# EAGLE design 2024-03-01_Twin_Io_Schematic (EAGLE 9.6.0)
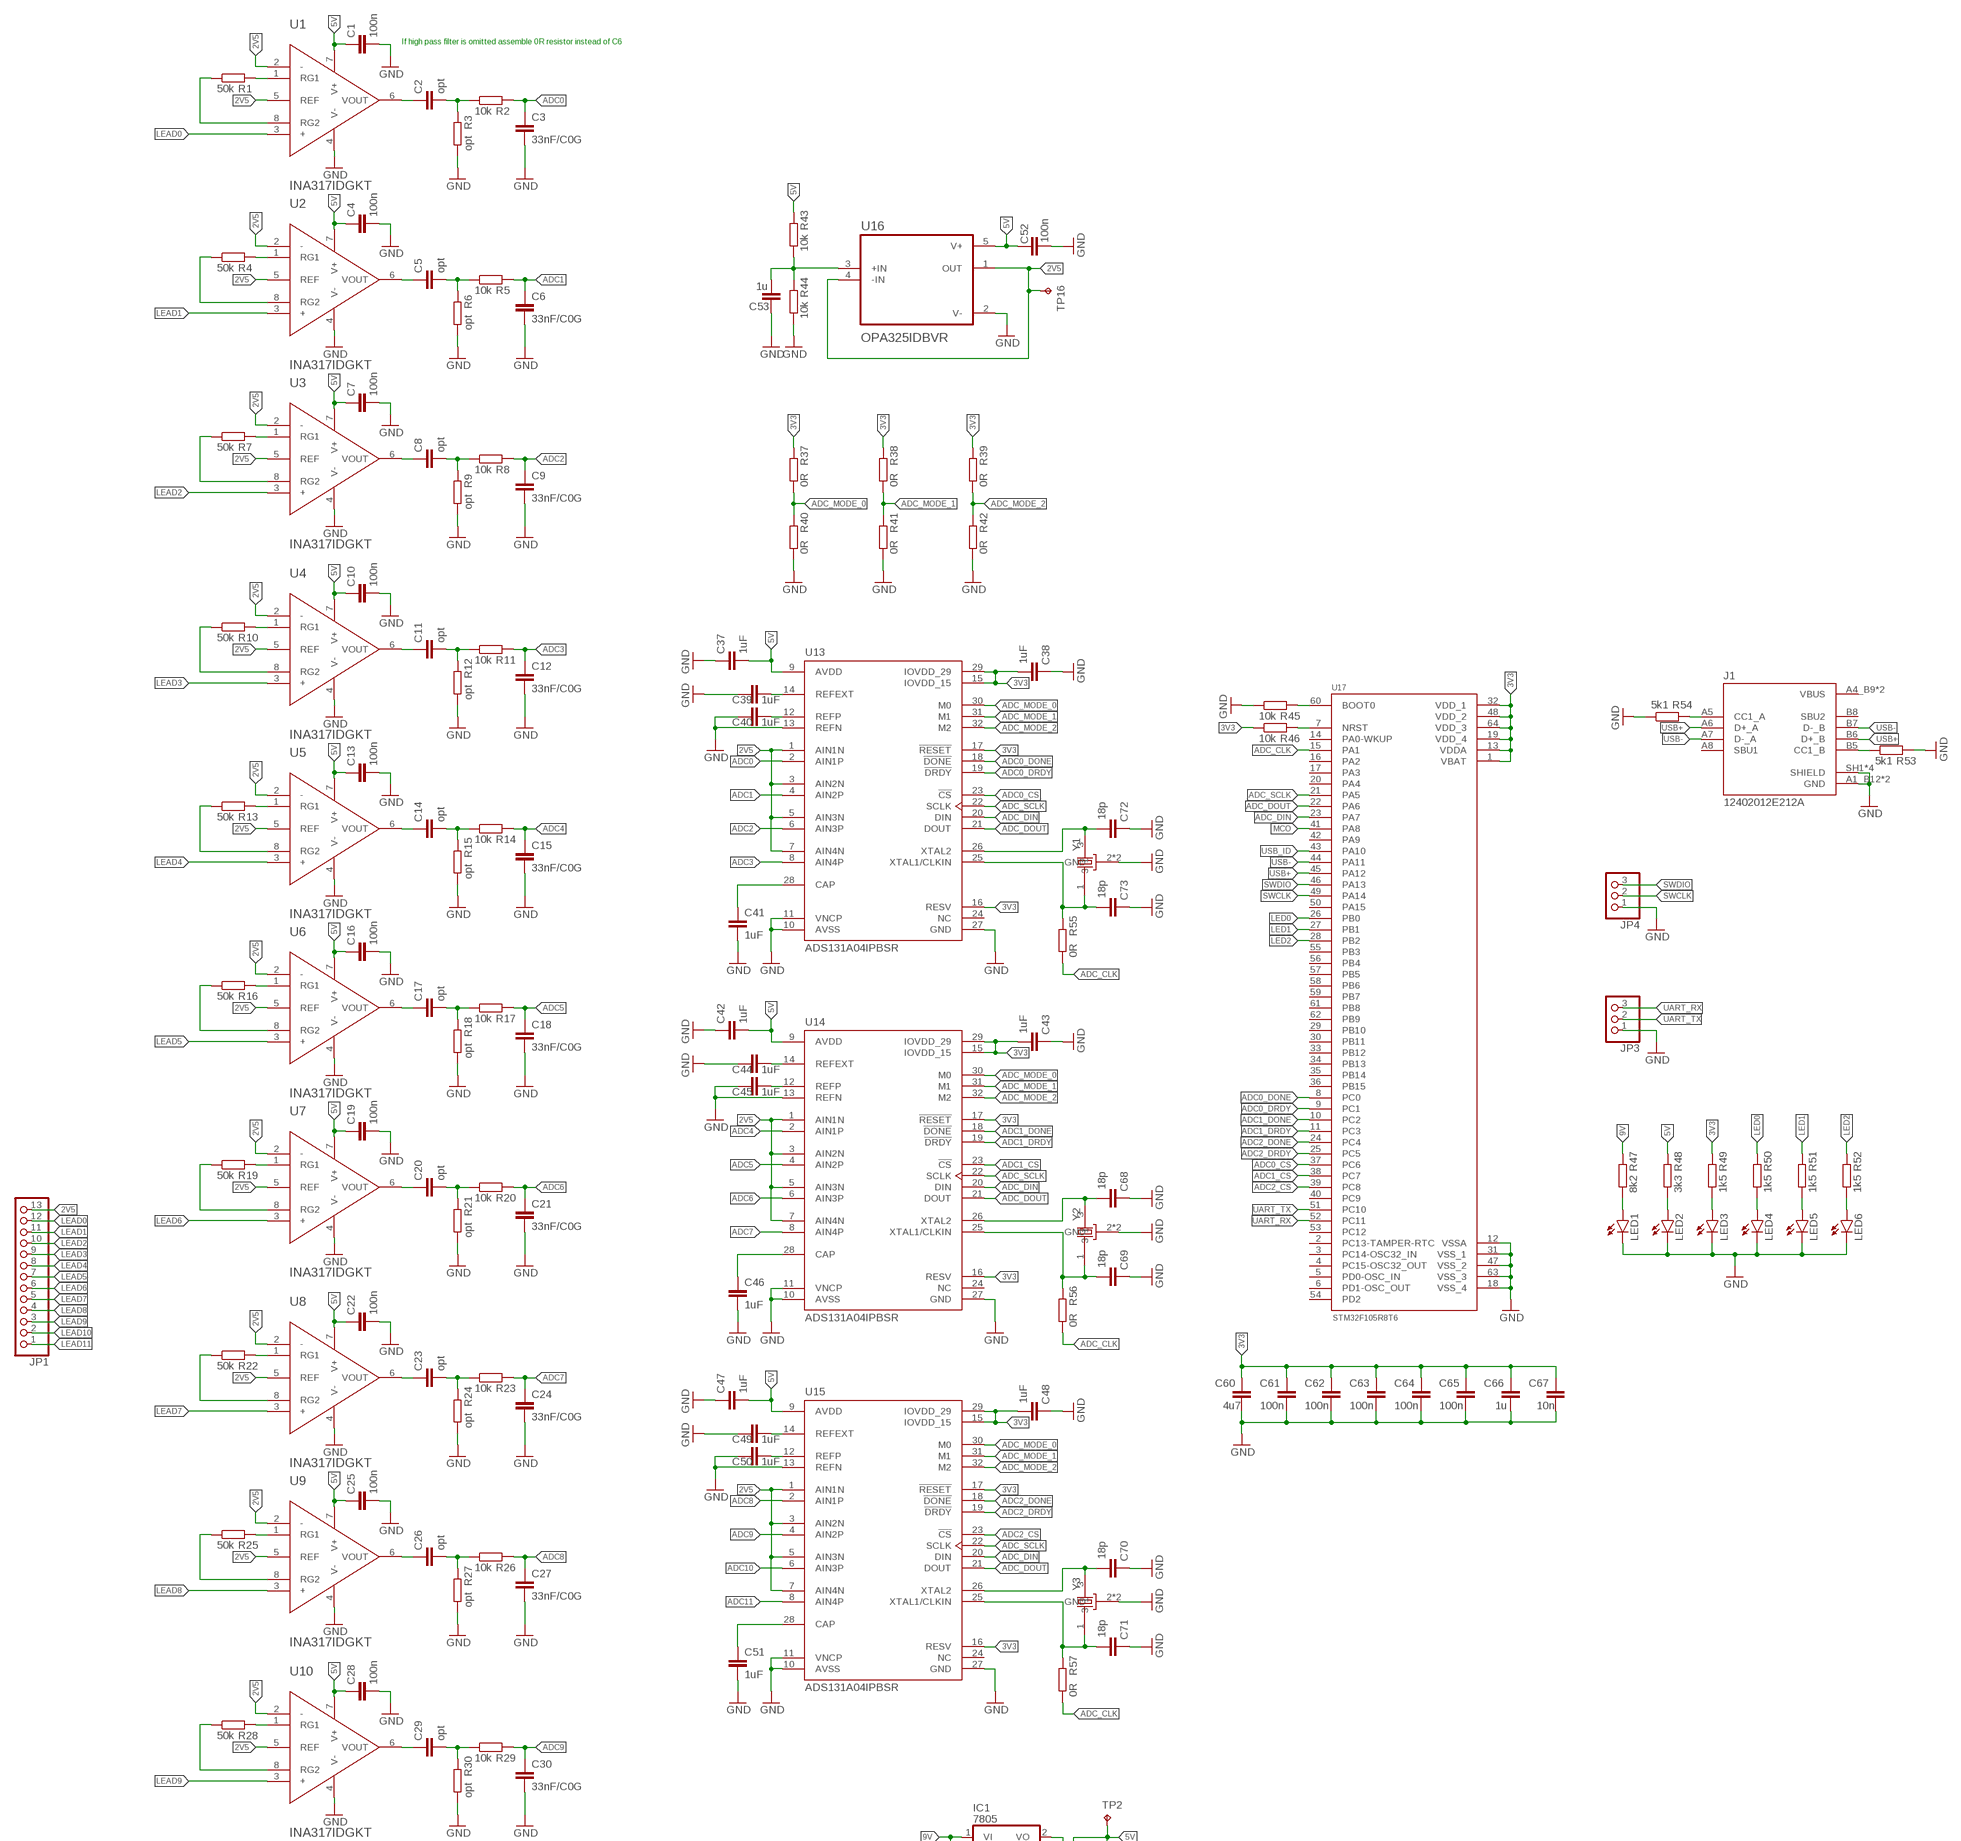
[diagram p0: schematic, sheet 1, part 1 of 2]
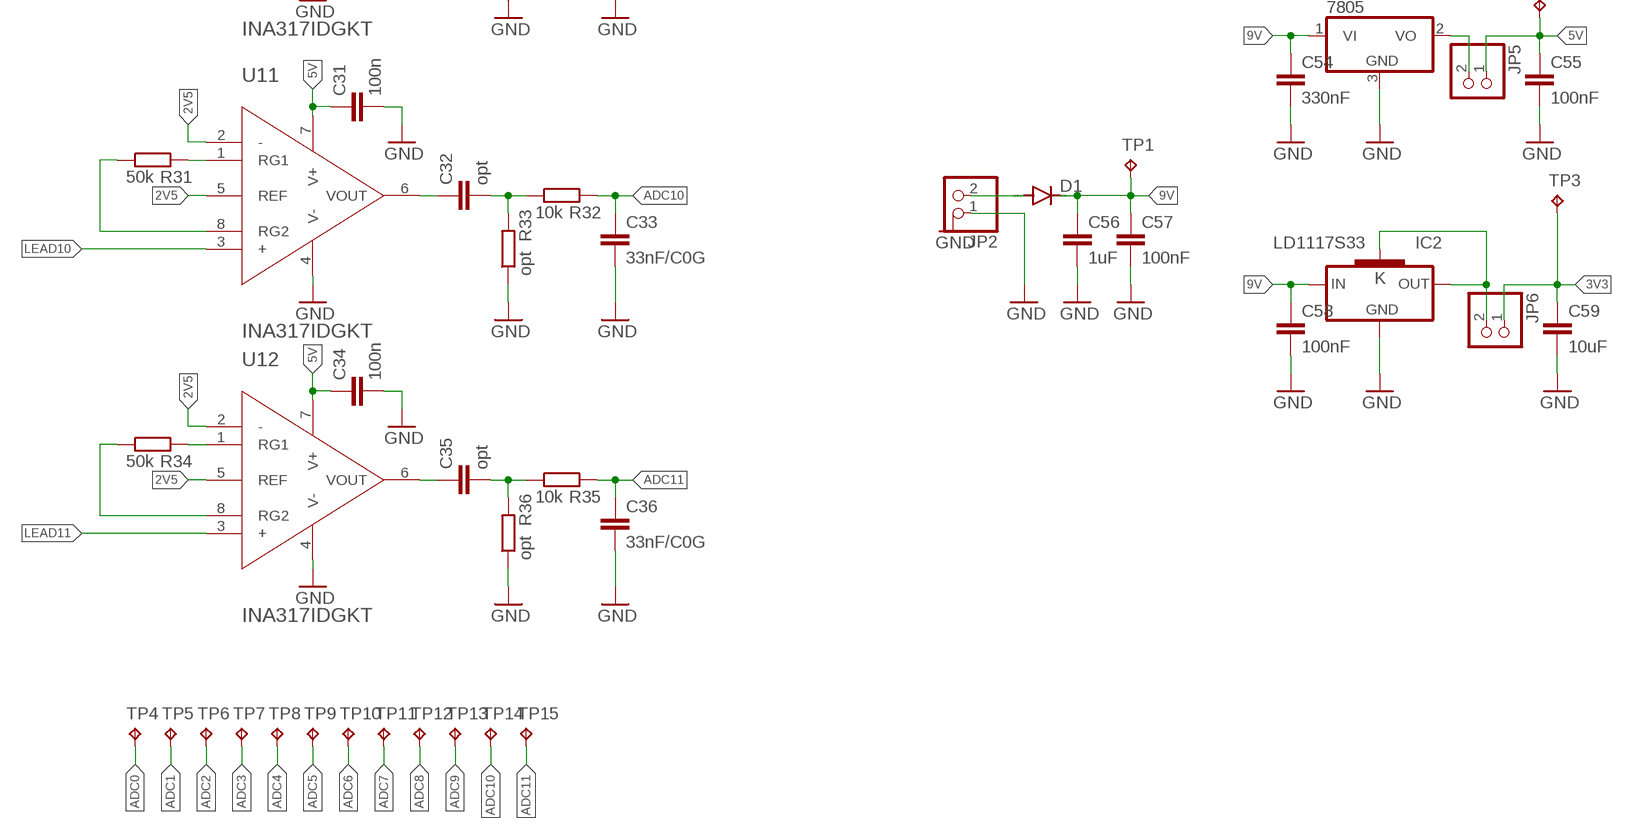
[diagram p1: schematic, sheet 1, part 2 of 2]

## Parts
C1  100n  C-EUC0603  [C0603]
C2  opt  C-EUC0603  [C0603]
C3  33nF/C0G  C-EUC0603  [C0603]
C4  100n  C-EUC0603  [C0603]
C5  opt  C-EUC0603  [C0603]
C6  33nF/C0G  C-EUC0603  [C0603]
C7  100n  C-EUC0603  [C0603]
C8  opt  C-EUC0603  [C0603]
C9  33nF/C0G  C-EUC0603  [C0603]
C10  100n  C-EUC0603  [C0603]
C11  opt  C-EUC0603  [C0603]
C12  33nF/C0G  C-EUC0603  [C0603]
C13  100n  C-EUC0603  [C0603]
C14  opt  C-EUC0603  [C0603]
C15  33nF/C0G  C-EUC0603  [C0603]
C16  100n  C-EUC0603  [C0603]
C17  opt  C-EUC0603  [C0603]
C18  33nF/C0G  C-EUC0603  [C0603]
C19  100n  C-EUC0603  [C0603]
C20  opt  C-EUC0603  [C0603]
C21  33nF/C0G  C-EUC0603  [C0603]
C22  100n  C-EUC0603  [C0603]
C23  opt  C-EUC0603  [C0603]
C24  33nF/C0G  C-EUC0603  [C0603]
C25  100n  C-EUC0603  [C0603]
C26  opt  C-EUC0603  [C0603]
C27  33nF/C0G  C-EUC0603  [C0603]
C28  100n  C-EUC0603  [C0603]
C29  opt  C-EUC0603  [C0603]
C30  33nF/C0G  C-EUC0603  [C0603]
C31  100n  C-EUC0603  [C0603]
C32  opt  C-EUC0603  [C0603]
C33  33nF/C0G  C-EUC0603  [C0603]
C34  100n  C-EUC0603  [C0603]
C35  opt  C-EUC0603  [C0603]
C36  33nF/C0G  C-EUC0603  [C0603]
C37  1uF  C-EUC0603  [C0603]
C38  1uF  C-EUC0603  [C0603]
C39  1uF  C-EUC0603  [C0603]
C40  1uF  C-EUC0603  [C0603]
C41  1uF  C-EUC0603  [C0603]
C42  1uF  C-EUC0603  [C0603]
C43  1uF  C-EUC0603  [C0603]
C44  1uF  C-EUC0603  [C0603]
C45  1uF  C-EUC0603  [C0603]
C46  1uF  C-EUC0603  [C0603]
C47  1uF  C-EUC0603  [C0603]
C48  1uF  C-EUC0603  [C0603]
C49  1uF  C-EUC0603  [C0603]
C50  1uF  C-EUC0603  [C0603]
C51  1uF  C-EUC0603  [C0603]
C52  100n  C-EUC0603  [C0603]
C53  1u  C-EUC0603  [C0603]
C54  330nF  C-EUC0603  [C0603]
C55  100nF  C-EUC0603  [C0603]
C56  1uF  C-EUC0603  [C0603]
C57  100nF  C-EUC0603  [C0603]
C58  100nF  C-EUC0603  [C0603]
C59  10uF  C-EUC0603  [C0603]
C60  4u7  C-EUC0603  [C0603]
C61  100n  C-EUC0603  [C0603]
C62  100n  C-EUC0603  [C0603]
C63  100n  C-EUC0603  [C0603]
C64  100n  C-EUC0603  [C0603]
C65  100n  C-EUC0603  [C0603]
C66  1u  C-EUC0603  [C0603]
C67  10n  C-EUC0603  [C0603]
C68  18p  C-EUC0603  [C0603]
C69  18p  C-EUC0603  [C0603]
C70  18p  C-EUC0603  [C0603]
C71  18p  C-EUC0603  [C0603]
C72  18p  C-EUC0603  [C0603]
C73  18p  C-EUC0603  [C0603]
D1  DIODE-DO214AA  [DO214AA]
IC1  7805  7806DT  [TO252]
IC2  LD1117S33  [SOT223]
J1  12402012E212A  [AMPHENOL_12402012E212A]
JP1  PINHD-1X13  [1X13]
JP2  PINHD-1X2  [1X02]
JP3  PINHD-1X3  [1X03]
JP4  PINHD-1X3  [1X03]
JP5  PINHD-1X2  [1X02]
JP6  PINHD-1X2  [1X02]
LED1  LEDSML1206  [SML1206]
LED2  LEDSML1206  [SML1206]
LED3  LEDSML1206  [SML1206]
LED4  LEDSML1206  [SML1206]
LED5  LEDSML1206  [SML1206]
LED6  LEDSML1206  [SML1206]
R1  50k  R-EU_R0603  [R0603]
R2  10k  R-EU_R0603  [R0603]
R3  opt  R-EU_R0603  [R0603]
R4  50k  R-EU_R0603  [R0603]
R5  10k  R-EU_R0603  [R0603]
R6  opt  R-EU_R0603  [R0603]
R7  50k  R-EU_R0603  [R0603]
R8  10k  R-EU_R0603  [R0603]
R9  opt  R-EU_R0603  [R0603]
R10  50k  R-EU_R0603  [R0603]
R11  10k  R-EU_R0603  [R0603]
R12  opt  R-EU_R0603  [R0603]
R13  50k  R-EU_R0603  [R0603]
R14  10k  R-EU_R0603  [R0603]
R15  opt  R-EU_R0603  [R0603]
R16  50k  R-EU_R0603  [R0603]
R17  10k  R-EU_R0603  [R0603]
R18  opt  R-EU_R0603  [R0603]
R19  50k  R-EU_R0603  [R0603]
R20  10k  R-EU_R0603  [R0603]
R21  opt  R-EU_R0603  [R0603]
R22  50k  R-EU_R0603  [R0603]
R23  10k  R-EU_R0603  [R0603]
R24  opt  R-EU_R0603  [R0603]
R25  50k  R-EU_R0603  [R0603]
R26  10k  R-EU_R0603  [R0603]
R27  opt  R-EU_R0603  [R0603]
R28  50k  R-EU_R0603  [R0603]
R29  10k  R-EU_R0603  [R0603]
R30  opt  R-EU_R0603  [R0603]
R31  50k  R-EU_R0603  [R0603]
R32  10k  R-EU_R0603  [R0603]
R33  opt  R-EU_R0603  [R0603]
R34  50k  R-EU_R0603  [R0603]
R35  10k  R-EU_R0603  [R0603]
R36  opt  R-EU_R0603  [R0603]
R37  0R  R-EU_R0603  [R0603]
R38  0R  R-EU_R0603  [R0603]
R39  0R  R-EU_R0603  [R0603]
R40  0R  R-EU_R0603  [R0603]
R41  0R  R-EU_R0603  [R0603]
R42  0R  R-EU_R0603  [R0603]
R43  10k  R-EU_R0603  [R0603]
R44  10k  R-EU_R0603  [R0603]
R45  10k  R-EU_R0603  [R0603]
R46  10k  R-EU_R0603  [R0603]
R47  8k2  R-EU_R0603  [R0603]
R48  3k3  R-EU_R0603  [R0603]
R49  1k5  R-EU_R0603  [R0603]
R50  1k5  R-EU_R0603  [R0603]
R51  1k5  R-EU_R0603  [R0603]
R52  1k5  R-EU_R0603  [R0603]
R53  5k1  R-EU_R0603  [R0603]
R54  5k1  R-EU_R0603  [R0603]
R55  0R  R-EU_R0603  [R0603]
R56  0R  R-EU_R0603  [R0603]
R57  0R  R-EU_R0603  [R0603]
TP1  TPPAD1-17  [P1-17]
TP2  TPPAD1-17  [P1-17]
TP3  TPPAD1-17  [P1-17]
TP4  TPPAD1-17  [P1-17]
TP5  TPPAD1-17  [P1-17]
TP6  TPPAD1-17  [P1-17]
TP7  TPPAD1-17  [P1-17]
TP8  TPPAD1-17  [P1-17]
TP9  TPPAD1-17  [P1-17]
TP10  TPPAD1-17  [P1-17]
TP11  TPPAD1-17  [P1-17]
TP12  TPPAD1-17  [P1-17]
TP13  TPPAD1-17  [P1-17]
TP14  TPPAD1-17  [P1-17]
TP15  TPPAD1-17  [P1-17]
TP16  TPPAD1-17  [P1-17]
U1  INA317IDGKT  [SOP65P490X110-8N]
U2  INA317IDGKT  [SOP65P490X110-8N]
U3  INA317IDGKT  [SOP65P490X110-8N]
U4  INA317IDGKT  [SOP65P490X110-8N]
U5  INA317IDGKT  [SOP65P490X110-8N]
U6  INA317IDGKT  [SOP65P490X110-8N]
U7  INA317IDGKT  [SOP65P490X110-8N]
U8  INA317IDGKT  [SOP65P490X110-8N]
U9  INA317IDGKT  [SOP65P490X110-8N]
U10  INA317IDGKT  [SOP65P490X110-8N]
U11  INA317IDGKT  [SOP65P490X110-8N]
U12  INA317IDGKT  [SOP65P490X110-8N]
U13  ADS131A04IPBSR  [QFP50P700X700X120-32N]
U14  ADS131A04IPBSR  [QFP50P700X700X120-32N]
U15  ADS131A04IPBSR  [QFP50P700X700X120-32N]
U16  OPA325IDBVR  [SOT95P280X145-5N]
U17  STM32F105R8T6  [QFP50P1200X1200X160-64N]
Y1  ABM3C-16.384MHZ-D4Y-T  [OSCCC500X320X110-4N]
Y2  ABM3C-16.384MHZ-D4Y-T  [OSCCC500X320X110-4N]
Y3  ABM3C-16.384MHZ-D4Y-T  [OSCCC500X320X110-4N]

## Nets
2V5: JP1.13 TP16.TP U1.2(-) U1.5(REF) U2.2(-) U2.5(REF) U3.2(-) U3.5(REF) U4.2(-) U4.5(REF) U5.2(-) U5.5(REF) U6.2(-) U6.5(REF) U7.2(-) U7.5(REF) U8.2(-) U8.5(REF) U9.2(-) U9.5(REF) U10.2(-) U10.5(REF) U11.2(-) U11.5(REF) U12.2(-) U12.5(REF) U13.1(AIN1N) U13.3(AIN2N) U13.5(AIN3N) U13.7(AIN4N) U14.1(AIN1N) U14.3(AIN2N) U14.5(AIN3N) U14.7(AIN4N) U15.1(AIN1N) U15.3(AIN2N) U15.5(AIN3N) U15.7(AIN4N) U16.1(OUT) U16.4(-IN)
3V3: C38.2 C43.2 C48.2 C59.1 C60.1 C61.1 C62.1 C63.1 C64.1 C65.1 C66.1 C67.1 JP6.1 R37.2 R38.2 R39.2 R46.1 R49.2 TP3.TP U13.15(IOVDD_15) U13.16(RESV) U13.17(!RESET) U13.29(IOVDD_29) U14.15(IOVDD_15) U14.16(RESV) U14.17(!RESET) U14.29(IOVDD_29) U15.15(IOVDD_15) U15.16(RESV) U15.17(!RESET) U15.29(IOVDD_29) U17.1(VBAT) U17.13(VDDA) U17.19(VDD_4) U17.32(VDD_1) U17.48(VDD_2) U17.64(VDD_3)
5V: C1.1 C4.1 C7.1 C10.1 C13.1 C16.1 C19.1 C22.1 C25.1 C28.1 C31.1 C34.1 C37.2 C42.2 C47.2 C52.1 C55.1 JP5.1 R43.2 R48.2 TP2.TP U1.7(V+) U2.7(V+) U3.7(V+) U4.7(V+) U5.7(V+) U6.7(V+) U7.7(V+) U8.7(V+) U9.7(V+) U10.7(V+) U11.7(V+) U12.7(V+) U13.9(AVDD) U14.9(AVDD) U15.9(AVDD) U16.5(V+)
9V: C54.1 C56.1 C57.1 C58.1 D1.C IC1.1(VI) IC2.3(IN) R47.2 TP1.TP
ADC0: C3.1 R2.2 TP4.TP U13.2(AIN1P)
ADC0_CS: U13.23(!CS) U17.37(PC6)
ADC0_DONE: U13.18(!DONE) U17.8(PC0)
ADC0_DRDY: U13.19(!DRDY) U17.9(PC1)
ADC1: C6.1 R5.2 TP5.TP U13.4(AIN2P)
ADC1_CS: U14.23(!CS) U17.38(PC7)
ADC1_DONE: U14.18(!DONE) U17.10(PC2)
ADC1_DRDY: U14.19(!DRDY) U17.11(PC3)
ADC2: C9.1 R8.2 TP6.TP U13.6(AIN3P)
ADC2_CS: U15.23(!CS) U17.39(PC8)
ADC2_DONE: U15.18(!DONE) U17.24(PC4)
ADC2_DRDY: U15.19(!DRDY) U17.25(PC5)
ADC3: C12.1 R11.2 TP7.TP U13.8(AIN4P)
ADC4: C15.1 R14.2 TP8.TP U14.2(AIN1P)
ADC5: C18.1 R17.2 TP9.TP U14.4(AIN2P)
ADC6: C21.1 R20.2 TP10.TP U14.6(AIN3P)
ADC7: C24.1 R23.2 TP11.TP U14.8(AIN4P)
ADC8: C27.1 R26.2 TP12.TP U15.2(AIN1P)
ADC9: C30.1 R29.2 TP13.TP U15.4(AIN2P)
ADC10: C33.1 R32.2 TP14.TP U15.6(AIN3P)
ADC11: C36.1 R35.2 TP15.TP U15.8(AIN4P)
ADC_CLK: R55.1 R56.1 R57.1 U17.15(PA1)
ADC_DIN: U13.20(DIN) U14.20(DIN) U15.20(DIN) U17.23(PA7)
ADC_DOUT: U13.21(DOUT) U14.21(DOUT) U15.21(DOUT) U17.22(PA6)
ADC_MODE_0: R37.1 R40.2 U13.30(M0) U14.30(M0) U15.30(M0)
ADC_MODE_1: R38.1 R41.2 U13.31(M1) U14.31(M1) U15.31(M1)
ADC_MODE_2: R39.1 R42.2 U13.32(M2) U14.32(M2) U15.32(M2)
ADC_SCLK: U13.22(SCLK) U14.22(SCLK) U15.22(SCLK) U17.21(PA5)
GND: C1.2 C3.2 C4.2 C6.2 C7.2 C9.2 C10.2 C12.2 C13.2 C15.2 C16.2 C18.2 C19.2 C21.2 C22.2 C24.2 C25.2 C27.2 C28.2 C30.2 C31.2 C33.2 C34.2 C36.2 C37.1 C38.1 C39.1 C40.1 C41.2 C42.1 C43.1 C44.1 C45.1 C46.2 C47.1 C48.1 C49.1 C50.1 C51.2 C52.2 C53.1 C54.2 C55.2 C56.2 C57.2 C58.2 C59.2 C60.2 C61.2 C62.2 C63.2 C64.2 C65.2 C66.2 C67.2 C68.1 C69.1 C70.1 C71.1 C72.1 C73.1 IC1.3(GND) IC2.1(GND) J1.A1_B12(GND) J1.B1_A12(GND) J1.SH1(SHIELD) J1.SH2(SHIELD) J1.SH3(SHIELD) J1.SH4(SHIELD) JP2.1 JP3.1 JP4.1 LED1.C LED2.C LED3.C LED4.C LED5.C LED6.C R3.1 R6.1 R9.1 R12.1 R15.1 R18.1 R21.1 R24.1 R27.1 R30.1 R33.1 R36.1 R40.1 R41.1 R42.1 R44.1 R45.1 R53.2 R54.1 U1.4(V-) U2.4(V-) U3.4(V-) U4.4(V-) U5.4(V-) U6.4(V-) U7.4(V-) U8.4(V-) U9.4(V-) U10.4(V-) U11.4(V-) U12.4(V-) U13.10(AVSS) U13.11(VNCP) U13.13(REFN) U13.27(GND) U14.10(AVSS) U14.11(VNCP) U14.13(REFN) U14.27(GND) U15.10(AVSS) U15.11(VNCP) U15.13(REFN) U15.27(GND) U16.2(V-) U17.12(VSSA) U17.18(VSS_4) U17.31(VSS_1) U17.47(VSS_2) U17.63(VSS_3) Y1.2(GND) Y1.4(GND) Y2.2(GND) Y2.4(GND) Y3.2(GND) Y3.4(GND)
LEAD0: JP1.12 U1.3(+)
LEAD1: JP1.11 U2.3(+)
LEAD2: JP1.10 U3.3(+)
LEAD3: JP1.9 U4.3(+)
LEAD4: JP1.8 U5.3(+)
LEAD5: JP1.7 U6.3(+)
LEAD6: JP1.6 U7.3(+)
LEAD7: JP1.5 U8.3(+)
LEAD8: JP1.4 U9.3(+)
LEAD9: JP1.3 U10.3(+)
LEAD10: JP1.2 U11.3(+)
LEAD11: JP1.1 U12.3(+)
LED0: R50.2 U17.26(PB0)
LED1: R51.2 U17.27(PB1)
LED2: R52.2 U17.28(PB2)
MCO: U17.41(PA8)
N$1: R1.2 U1.1(RG1)
N$2: R1.1 U1.8(RG2)
N$3: C2.1 U1.6(VOUT)
N$4: C2.2 R2.1 R3.2
N$5: D1.A JP2.2
N$6: C41.1 U13.28(CAP)
N$7: C72.2 U13.26(XTAL2) Y1.3
N$8: C73.2 R55.2 U13.25(XTAL1/CLKIN) Y1.1
N$9: C40.2 U13.12(REFP)
N$10: C39.2 U13.14(REFEXT)
N$11: R4.2 U2.1(RG1)
N$12: R4.1 U2.8(RG2)
N$13: C5.1 U2.6(VOUT)
N$14: C5.2 R5.1 R6.2
N$15: R7.2 U3.1(RG1)
N$16: R7.1 U3.8(RG2)
N$17: C8.1 U3.6(VOUT)
N$18: C8.2 R8.1 R9.2
N$19: R10.2 U4.1(RG1)
N$20: R10.1 U4.8(RG2)
N$21: C11.1 U4.6(VOUT)
N$22: C11.2 R11.1 R12.2
N$23: R13.2 U5.1(RG1)
N$24: R13.1 U5.8(RG2)
N$25: C14.1 U5.6(VOUT)
N$26: C14.2 R14.1 R15.2
N$27: R16.2 U6.1(RG1)
N$28: R16.1 U6.8(RG2)
N$29: C17.1 U6.6(VOUT)
N$30: C17.2 R17.1 R18.2
N$31: R19.2 U7.1(RG1)
N$32: R19.1 U7.8(RG2)
N$33: C20.1 U7.6(VOUT)
N$34: C20.2 R20.1 R21.2
N$35: R22.2 U8.1(RG1)
N$36: R22.1 U8.8(RG2)
N$37: C23.1 U8.6(VOUT)
N$38: C23.2 R23.1 R24.2
N$39: R25.2 U9.1(RG1)
N$40: R25.1 U9.8(RG2)
N$41: C26.1 U9.6(VOUT)
N$42: C26.2 R26.1 R27.2
N$43: C69.2 R56.2 U14.25(XTAL1/CLKIN) Y2.1
N$44: C46.1 U14.28(CAP)
N$45: C44.2 U14.14(REFEXT)
N$46: C68.2 U14.26(XTAL2) Y2.3
N$47: C45.2 U14.12(REFP)
N$48: C70.2 U15.26(XTAL2) Y3.3
N$49: C51.1 U15.28(CAP)
N$50: C49.2 U15.14(REFEXT)
N$51: C71.2 R57.2 U15.25(XTAL1/CLKIN) Y3.1
N$52: C50.2 U15.12(REFP)
N$53: R28.2 U10.1(RG1)
N$54: R28.1 U10.8(RG2)
N$55: C29.1 U10.6(VOUT)
N$56: C29.2 R29.1 R30.2
N$57: R31.2 U11.1(RG1)
N$58: R31.1 U11.8(RG2)
N$59: C32.1 U11.6(VOUT)
N$60: C32.2 R32.1 R33.2
N$61: R34.2 U12.1(RG1)
N$62: R34.1 U12.8(RG2)
N$63: C35.1 U12.6(VOUT)
N$64: C35.2 R35.1 R36.2
N$65: R45.2 U17.60(BOOT0)
N$66: R46.2 U17.7(NRST)
N$67: C53.2 R43.1 R44.2 U16.3(+IN)
N$68: LED1.A R47.1
N$69: LED2.A R48.1
N$70: LED3.A R49.1
N$71: LED4.A R50.1
N$72: LED5.A R51.1
N$73: LED6.A R52.1
N$74: J1.A5(CC1_A) R54.2
N$75: J1.B5(CC1_B) R53.1
N$76: IC1.2(VO) JP5.2
N$78: IC2.2(OUT) IC2.4(K) JP6.2
SWCLK: JP4.2 U17.49(PA14)
SWDIO: JP4.3 U17.46(PA13)
UART_RX: JP3.3 U17.52(PC11)
UART_TX: JP3.2 U17.51(PC10)
USB+: J1.A6(D+_A) J1.B6(D+_B) U17.45(PA12)
USB-: J1.A7(D-_A) J1.B7(D-_B) U17.44(PA11)
USB_ID: U17.43(PA10)
Unconnected: J1.A8(SBU1) J1.B8(SBU2) U13.24(NC) U14.24(NC) U15.24(NC) U17.2(PC13-TAMPER-RTC) U17.3(PC14-OSC32_IN) U17.4(PC15-OSC32_OUT) U17.5(PD0-OSC_IN) U17.6(PD1-OSC_OUT) U17.14(PA0-WKUP) U17.16(PA2) U17.17(PA3) U17.20(PA4) U17.29(PB10) U17.30(PB11) U17.33(PB12) U17.34(PB13) U17.35(PB14) U17.36(PB15) U17.40(PC9) U17.42(PA9) U17.50(PA15) U17.53(PC12) U17.54(PD2) U17.55(PB3) U17.56(PB4) U17.57(PB5) U17.58(PB6) U17.59(PB7) U17.61(PB8) U17.62(PB9)

## Notes on the sheet
- If high pass filter is omitted assemble 0R resistor instead of C6

## Power pins joined to a net without a drawn wire
VBUS: J1.A4_B9(VBUS) J1.B4_A9(VBUS)

## Library data of the parts
C1-C73 = rcl:C-EU: CAPACITOR, European symbol; SPICEPREFIX: C
D1 = diode:DIODE-: DIODE
IC1 = linear:78*: Positive VOLTAGE REGULATOR Source: http://cache.national.com/ds/LM/LM78L05.pdf http://www.fairchildsemi.com/ds/LM/LM7805.pdf
IC2 = LD1117S33:LD1117S33: VOLTAGE REGULATOR SMD 3,3V Check availability <https://pricing.snapeda.com/parts/LD1117S33/STMicroelectronics/view-part?ref=eda>; AVAILABILITY: In Stock; CHECK_PRICES: https://www.snapeda.com/parts/LD1117S33/STMicroelectronics/view-part/?ref=eda; DESCRIPTION: Linear Voltage Regulator IC Positive Fixed 1 Output 800mA SOT-223; MF: STMicroelectronics; MP: LD1117S33; PACKAGE: TO-261-4 STMicroelectronics; PRICE: None; PURCHASE-URL: https://www.snapeda.com/api/url_track_click_mouser/?unipart_id=558863&manufacturer=STMicroelectronics&part_name=LD1117S33&search_term=ld1117; SNAPEDA_LINK: https://www.snapeda.com/parts/LD1117S33/STMicroelectronics/view-part/?ref=snap
J1 = USB-C:12402012E212A: Check availability <https://pricing.snapeda.com/parts/12402012E212A/Amphenol/view-part?ref=eda>; AVAILABILITY: In Stock; CHECK_PRICES: https://www.snapeda.com/parts/12402012E212A/Amphenol/view-part/?ref=eda; DESCRIPTION: USB2.0, Type C, Top mount, CH 1.68mm, Dual Row SMT; MF: Amphenol; MP: 12402012E212A; PACKAGE: None; PRICE: None; PURCHASE-URL: https://www.snapeda.com/api/url_track_click_mouser/?unipart_id=12292287&manufacturer=Amphenol&part_name=12402012E212A&search_term= 12402012e212a; SNAPEDA_LINK: https://www.snapeda.com/parts/12402012E212A/Amphenol/view-part/?ref=snap
JP1 = pinhead:PINHD-1X13: PIN HEADER
JP2 JP5 JP6 = pinhead:PINHD-1X2: PIN HEADER
JP3 JP4 = pinhead:PINHD-1X3: PIN HEADER
LED1-LED6 = led:LED: LED OSRAM: - CHIPLED LG R971, LG N971, LY N971, LG Q971, LY Q971, LO R971, LY R971 LH N974, LH R974 LS Q976, LO Q976, LY Q976 LO Q996 - Hyper CHIPLED LW Q18S LB Q993, LB Q99A, LB R99A - SideLED LS A670, LO A670, LY A670, LG A670, LP A670 LB A673, LV A673, LT A673, LW A673 LH A674 LY A675 LS A676, LA A676, LO A676, LY A676, LW A676 LS A679, LY A679, LG A679 - Hyper Micro SIDELED® LS Y876, LA Y876, LO Y876, LY Y876 LT Y87S - SmartLED LW L88C, LW L88S LB L89C, LB L89S, LG L890 LS L89K, LO L89K, LY L89K LS L896, LA L896, LO L896, LY L896 - TOPLED LS T670, LO T670, LY T670, LG T670, LP T670 LSG T670, LSP T670, LSY T670, LOP T670, LYG T670 LG T671, LOG T671, LSG T671 LB T673, LV T673, LT T673, LW T673 LH T674 LS T676, LA T676, LO T676, LY T676, LB T676, LH T676, LSB T676, LW T676 LB T67C, LV T67C, LT T67C, LS T67K, LO T67K, LY T67K, LW E67C LS E67B, LA E67B, LO E67B, LY E67B, LB E67C, LV E67C, LT E67C LW T67C LS T679, LY T679, LG T679 LS T770, LO T770, LY T770, LG T770, LP T770 LB T773, LV T773, LT T773, LW T773 LH T774 LS E675, LA E675, LY E675, LS T675 LS T776, LA T776, LO T776, LY T776, LB T776 LHGB T686 LT T68C, LB T68C - Hyper Mini TOPLED® LB M676 - Mini TOPLED Santana® LG M470 LS M47K, LO M47K, LY M47K Source: http://www.osram.convergy.de LUXEON: - LUMILED® LXK2-PW12-R00, LXK2-PW12-S00, LXK2-PW14-U00, LXK2-PW14-V00 LXK2-PM12-R00, LXK2-PM12-S00, LXK2-PM14-U00 LXK2-PE12-Q00, LXK2-PE12-R00, LXK2-PE12-S00, LXK2-PE14-T00, LXK2-PE14-U00 LXK2-PB12-K00, LXK2-PB12-L00, LXK2-PB12-M00, LXK2-PB14-N00, LXK2-PB14-P00, LXK2-PB14-Q00 LXK2-PR12-L00, LXK2-PR12-M00, LXK2-PR14-Q00, LXK2-PR14-R00 LXK2-PD12-Q00, LXK2-PD12-R00, LXK2-PD12-S00 LXK2-PH12-R00, LXK2-PH12-S00 LXK2-PL12-P00, LXK2-PL12-Q00, LXK2-PL12-R00 Source: www.luxeon.com KINGBRIGHT: KA-3528ASYC Source: www.kingbright.com
R1-R57 = rcl:R-EU_: RESISTOR, European symbol; SPICEPREFIX: R
TP1-TP16 = testpad:TP: Test pad
U1-U12 = INA317IDGKT:INA317IDGKT: Check availability <https://pricing.snapeda.com/parts/INA317IDGKT/Texas%20Instruments/view-part?ref=eda>; AVAILABILITY: In Stock; CHECK_PRICES: https://www.snapeda.com/parts/INA317IDGKT/Texas+Instruments/view-part/?ref=eda; DESCRIPTION: Micro-power (50µA), zero-drift (75µV offset, 0.3µV/˚C), precision RRO instrumentation amplifier; MF: Texas Instruments; MP: INA317IDGKT; PACKAGE: VSSOP-8 Texas Instruments; PRICE: None; PURCHASE-URL: https://www.snapeda.com/api/url_track_click_mouser/?unipart_id=3077446&manufacturer=Texas Instruments&part_name=INA317IDGKT&search_term=ina317; SNAPEDA_LINK: https://www.snapeda.com/parts/INA317IDGKT/Texas+Instruments/view-part/?ref=snap
U13-U15 = ADS131A04IPBSR:ADS131A04IPBSR: 24-bit 128-kSPS 4-channel simultaneous-sampling delta-sigma ADC 32-TQFP -40 to 125 Check availability <https://pricing.snapeda.com/parts/ADS131A04IPBSR/Texas%20Instruments/view-part?ref=eda>; AVAILABILITY: In Stock; CHECK_PRICES: https://www.snapeda.com/parts/ADS131A04IPBSR/Texas+Instruments/view-part/?ref=eda; DESCRIPTION: 24-bit 128-kSPS 4-channel simultaneous-sampling delta-sigma ADC; MF: Texas Instruments; MP: ADS131A04IPBSR; PACKAGE: TQFP-32 Texas Instruments; PRICE: None; PURCHASE-URL: https://www.snapeda.com/api/url_track_click_mouser/?unipart_id=547394&manufacturer=Texas Instruments&part_name=ADS131A04IPBSR&search_term=ads131; SNAPEDA_LINK: https://www.snapeda.com/parts/ADS131A04IPBSR/Texas+Instruments/view-part/?ref=snap
U16 = OPA325IDBVR:OPA325IDBVR: Check availability <https://pricing.snapeda.com/parts/OPA325IDBVR/Texas%20Instruments/view-part?ref=eda>; AVAILABILITY: In Stock; CHECK_PRICES: https://www.snapeda.com/parts/OPA325IDBVR/Texas+Instruments/view-part/?ref=eda; DESCRIPTION: Low noise (10nV/rtHz), wide bandwidth (10MHz), low power (0.65mA), zero crossover op amp; MF: Texas Instruments; MP: OPA325IDBVR; PACKAGE: SOT-23-5 Texas Instruments; PRICE: None; PURCHASE-URL: https://www.snapeda.com/api/url_track_click_mouser/?unipart_id=4794140&manufacturer=Texas Instruments&part_name=OPA325IDBVR&search_term=opa325; SNAPEDA_LINK: https://www.snapeda.com/parts/OPA325IDBVR/Texas+Instruments/view-part/?ref=snap
U17 = STM32F105R8T6:STM32F105R8T6: Mainstream Connectivity line, ARM Cortex-M3 with 64 Kbytes Flash, 72 MHz CPU, CAN, USB 2.0 OTG Check availability <https://pricing.snapeda.com/parts/STM32F105R8T6/STMicroelectronics/view-part?ref=eda>; AVAILABILITY: In Stock; CHECK_PRICES: https://www.snapeda.com/parts/STM32F105R8T6/STMicroelectronics/view-part/?ref=eda; DESCRIPTION: ARM® Cortex®-M3 STM32F1 Microcontroller IC 32-Bit 72MHz 64KB (64K x 8) FLASH 64-LQFP (10x10); MF: STMicroelectronics; MP: STM32F105R8T6; PACKAGE: LQFP-64 STMicroelectronics; PRICE: None; PURCHASE-URL: https://www.snapeda.com/api/url_track_click_mouser/?unipart_id=423032&manufacturer=STMicroelectronics&part_name=STM32F105R8T6&search_term=stm32f105r8; SNAPEDA_LINK: https://www.snapeda.com/parts/STM32F105R8T6/STMicroelectronics/view-part/?ref=snap
Y1-Y3 = ABM3C-16.384MHZ-D4Y-T:ABM3C-16.384MHZ-D4Y-T: Ceramic SMD Crystal Check availability <https://pricing.snapeda.com/parts/ABM3C-16.384MHZ-D4Y-T/Abracon/view-part?ref=eda>; AVAILABILITY: In Stock; CHECK_PRICES: https://www.snapeda.com/parts/ABM3C-16.384MHZ-D4Y-T/Abracon+LLC/view-part/?ref=eda; DESCRIPTION: 16.384 MHz ±30ppm Crystal 18pF 50 Ohms 4-SMD, No Lead; MF: Abracon; MP: ABM3C-16.384MHZ-D4Y-T; PACKAGE: SMD-4 Abracon; PRICE: None; PURCHASE-URL: https://www.snapeda.com/api/url_track_click_mouser/?unipart_id=480615&manufacturer=Abracon&part_name=ABM3C-16.384MHZ-D4Y-T&search_term=abm3c-16.384mhz-d4y-t; SNAPEDA_LINK: https://www.snapeda.com/parts/ABM3C-16.384MHZ-D4Y-T/Abracon+LLC/view-part/?ref=snap

## Board
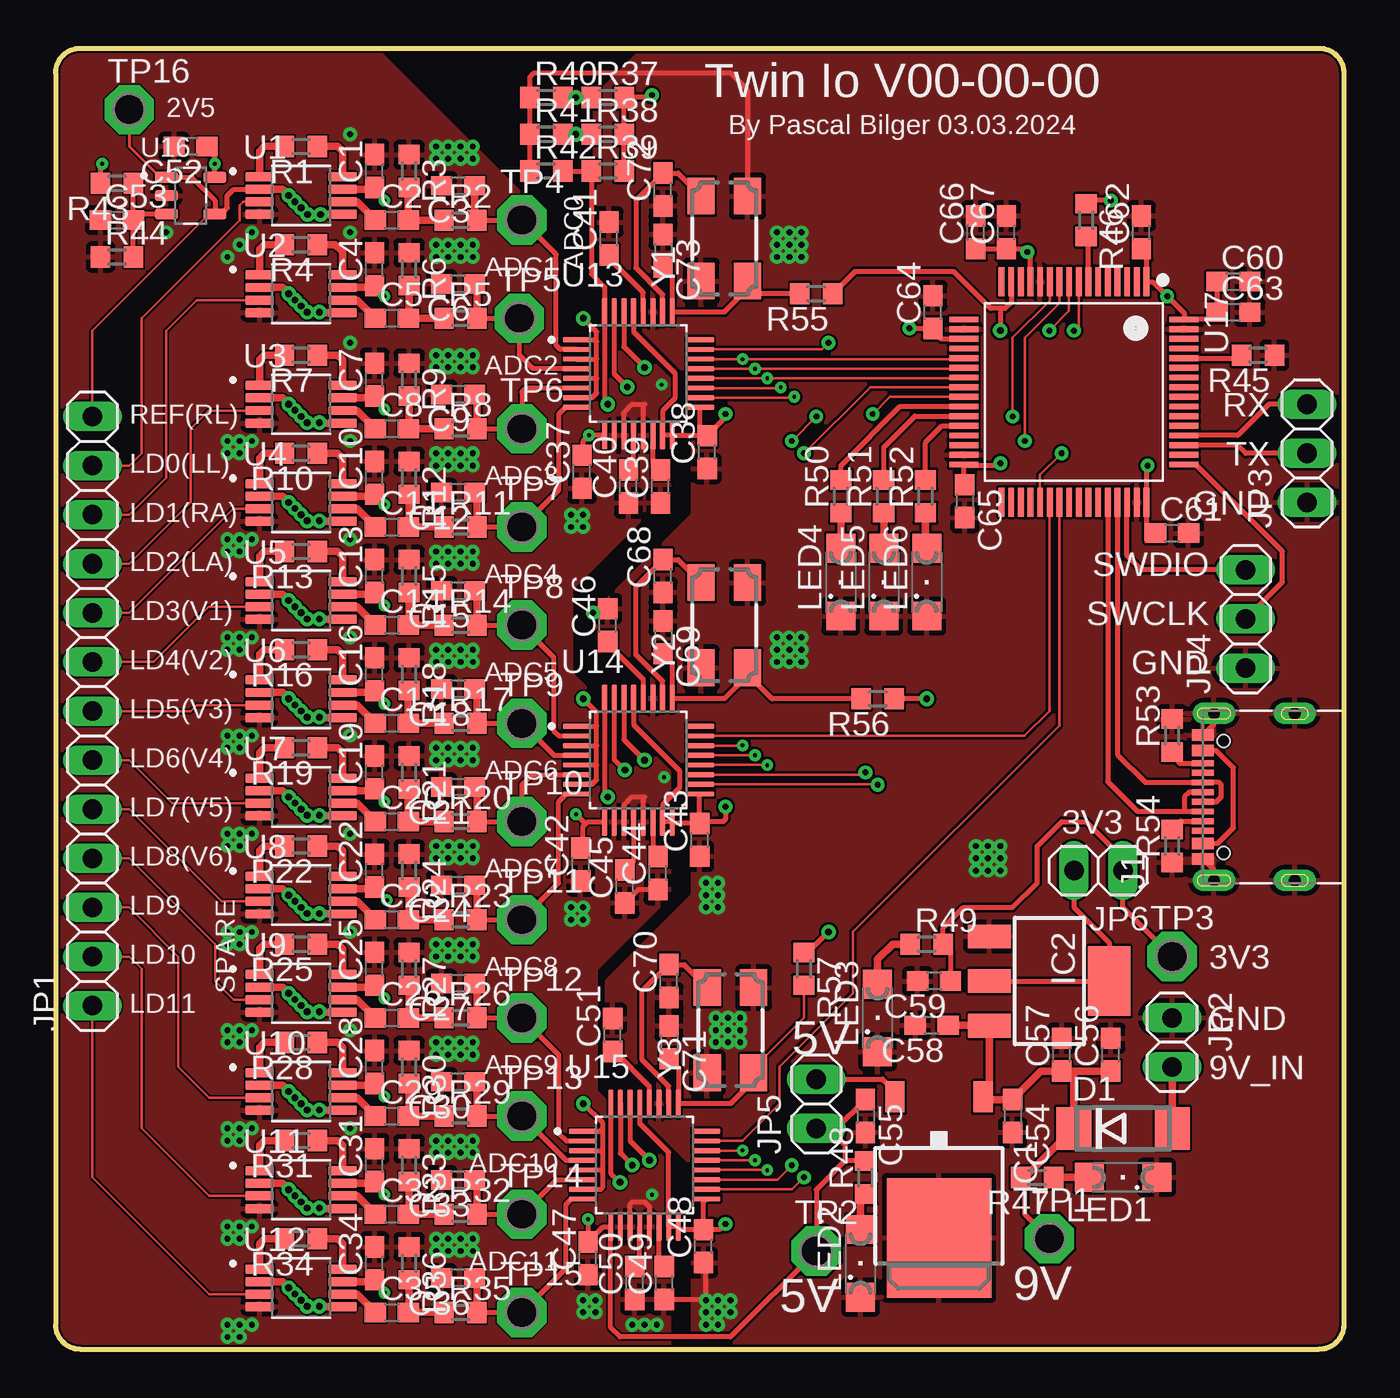
[diagram p2: board, top side]
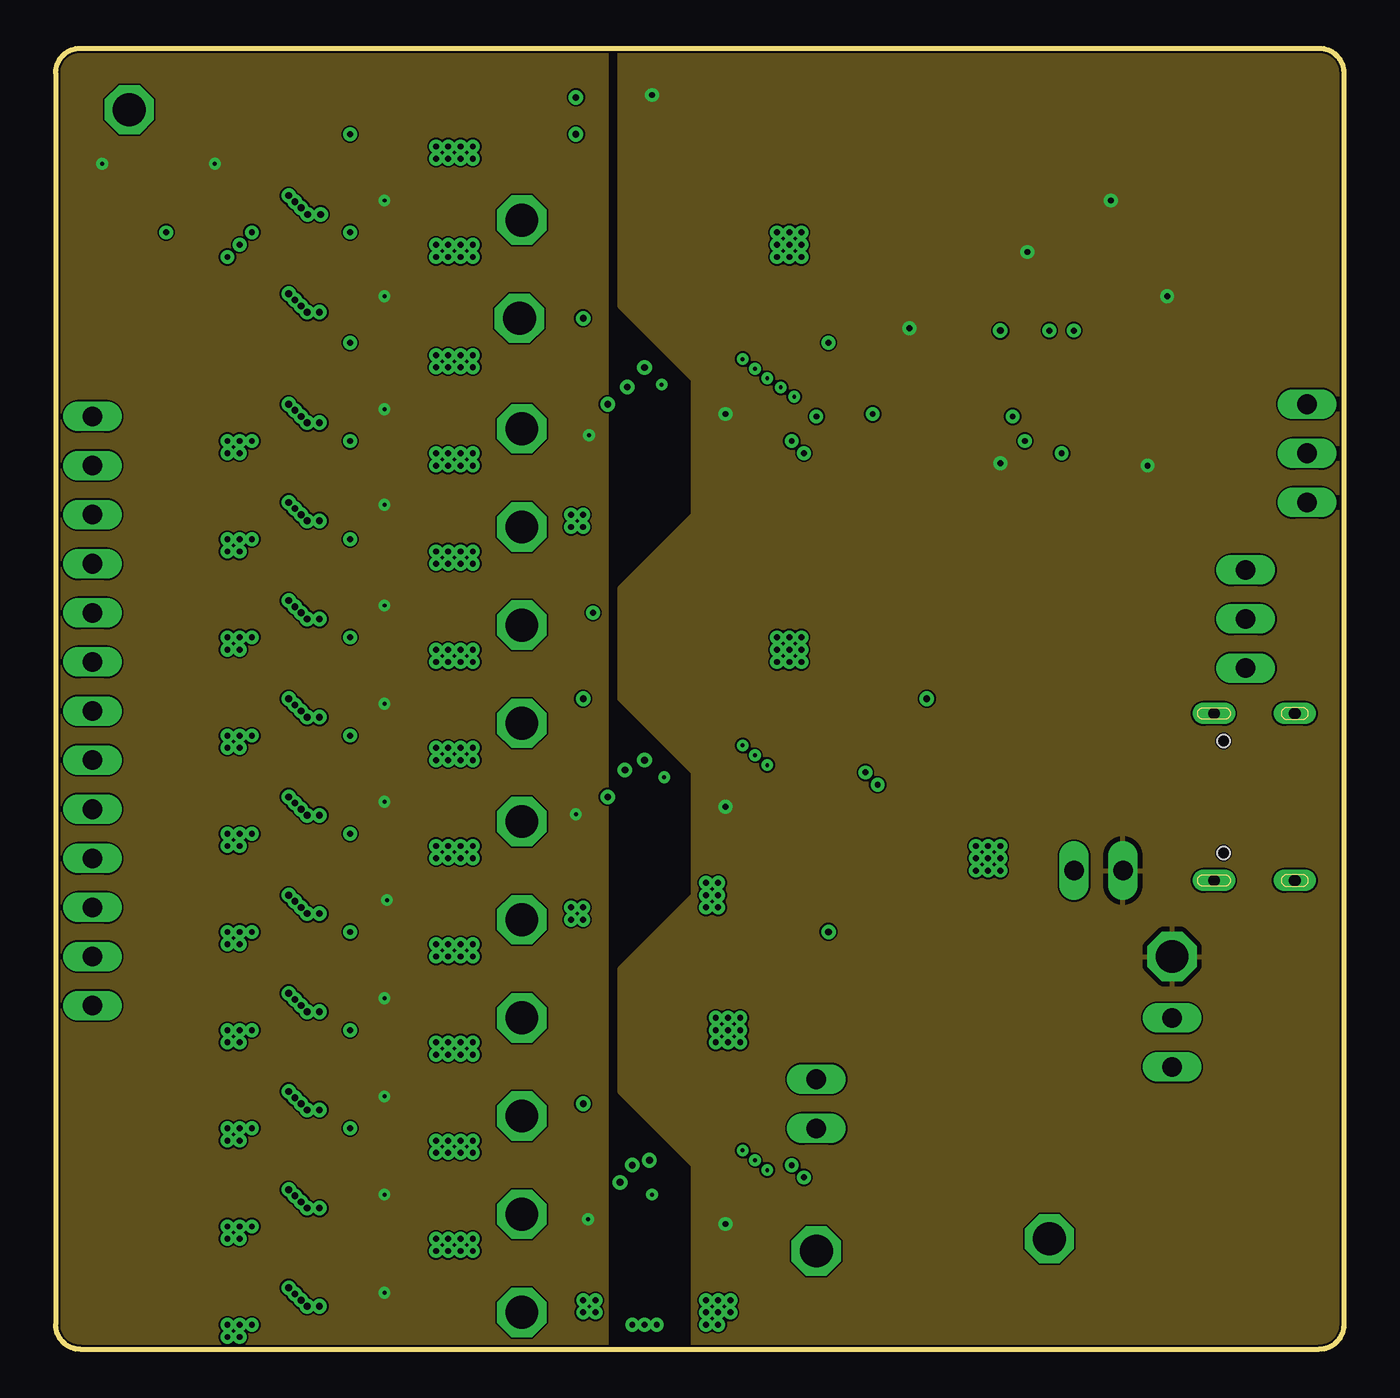
[diagram p3: board, inner layer Route2]
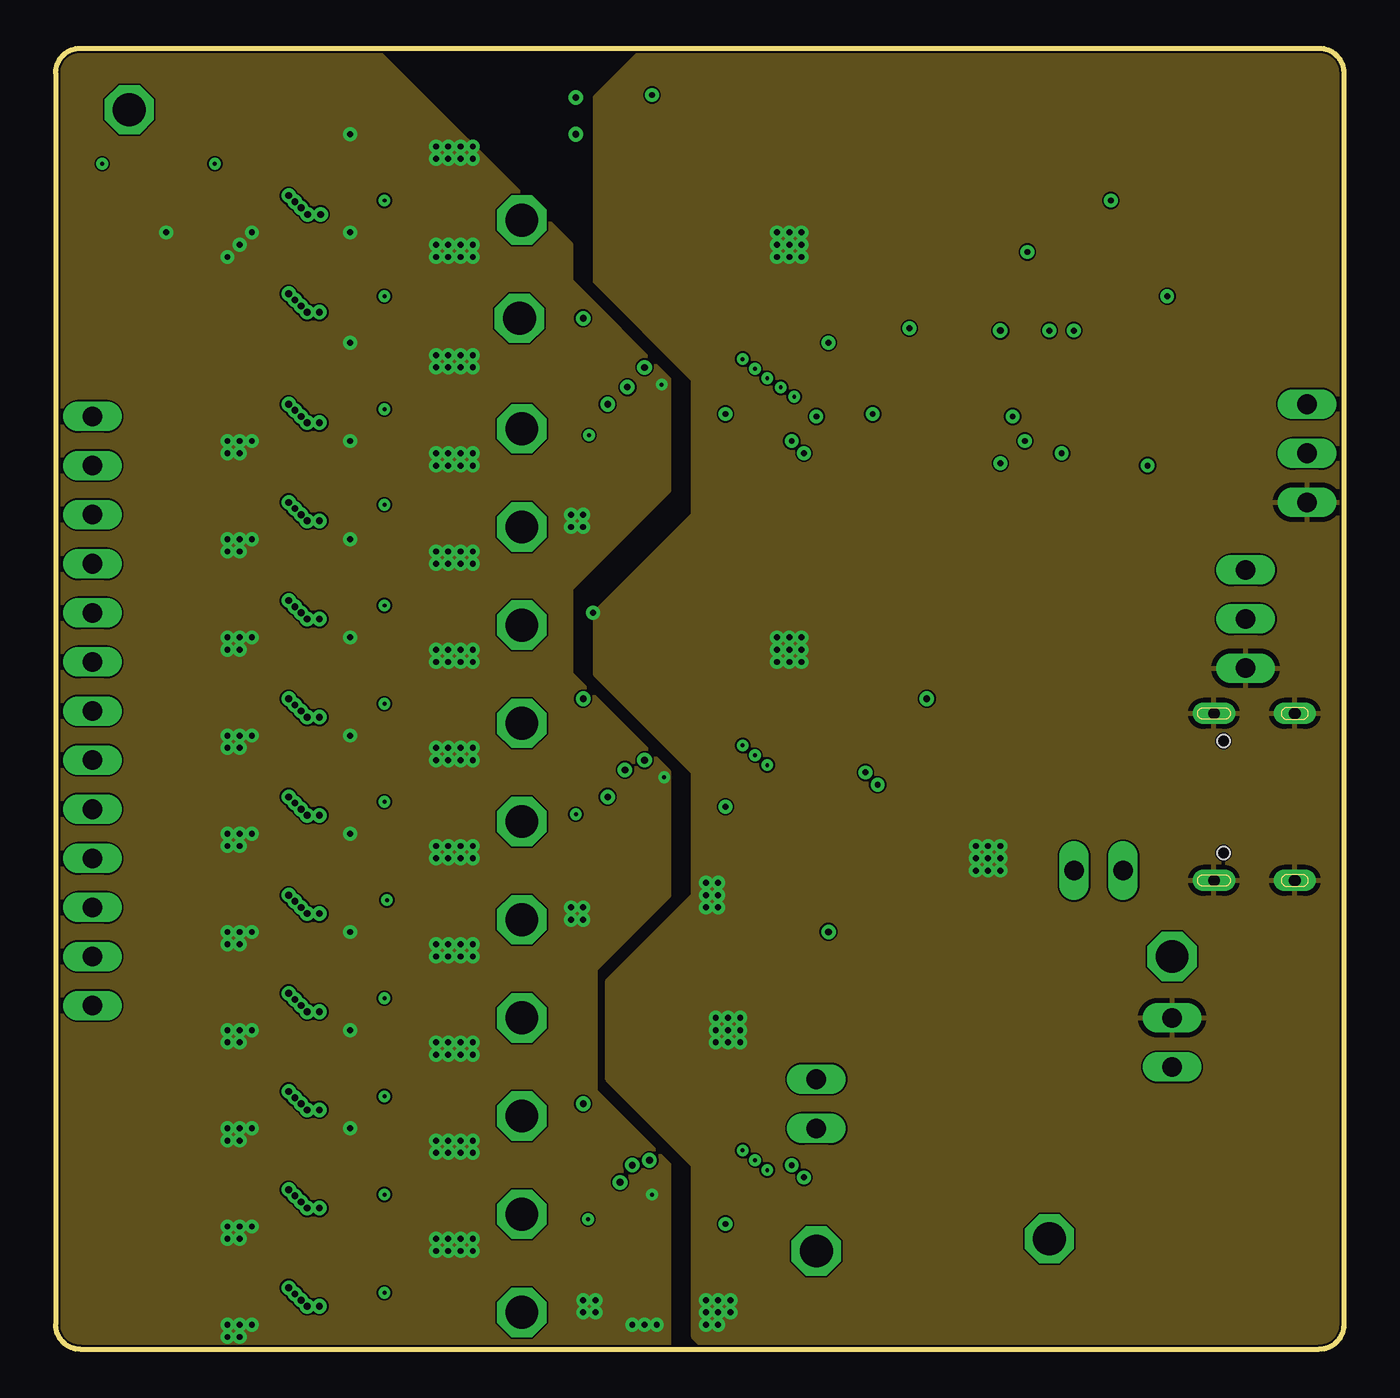
[diagram p4: board, inner layer Route15]
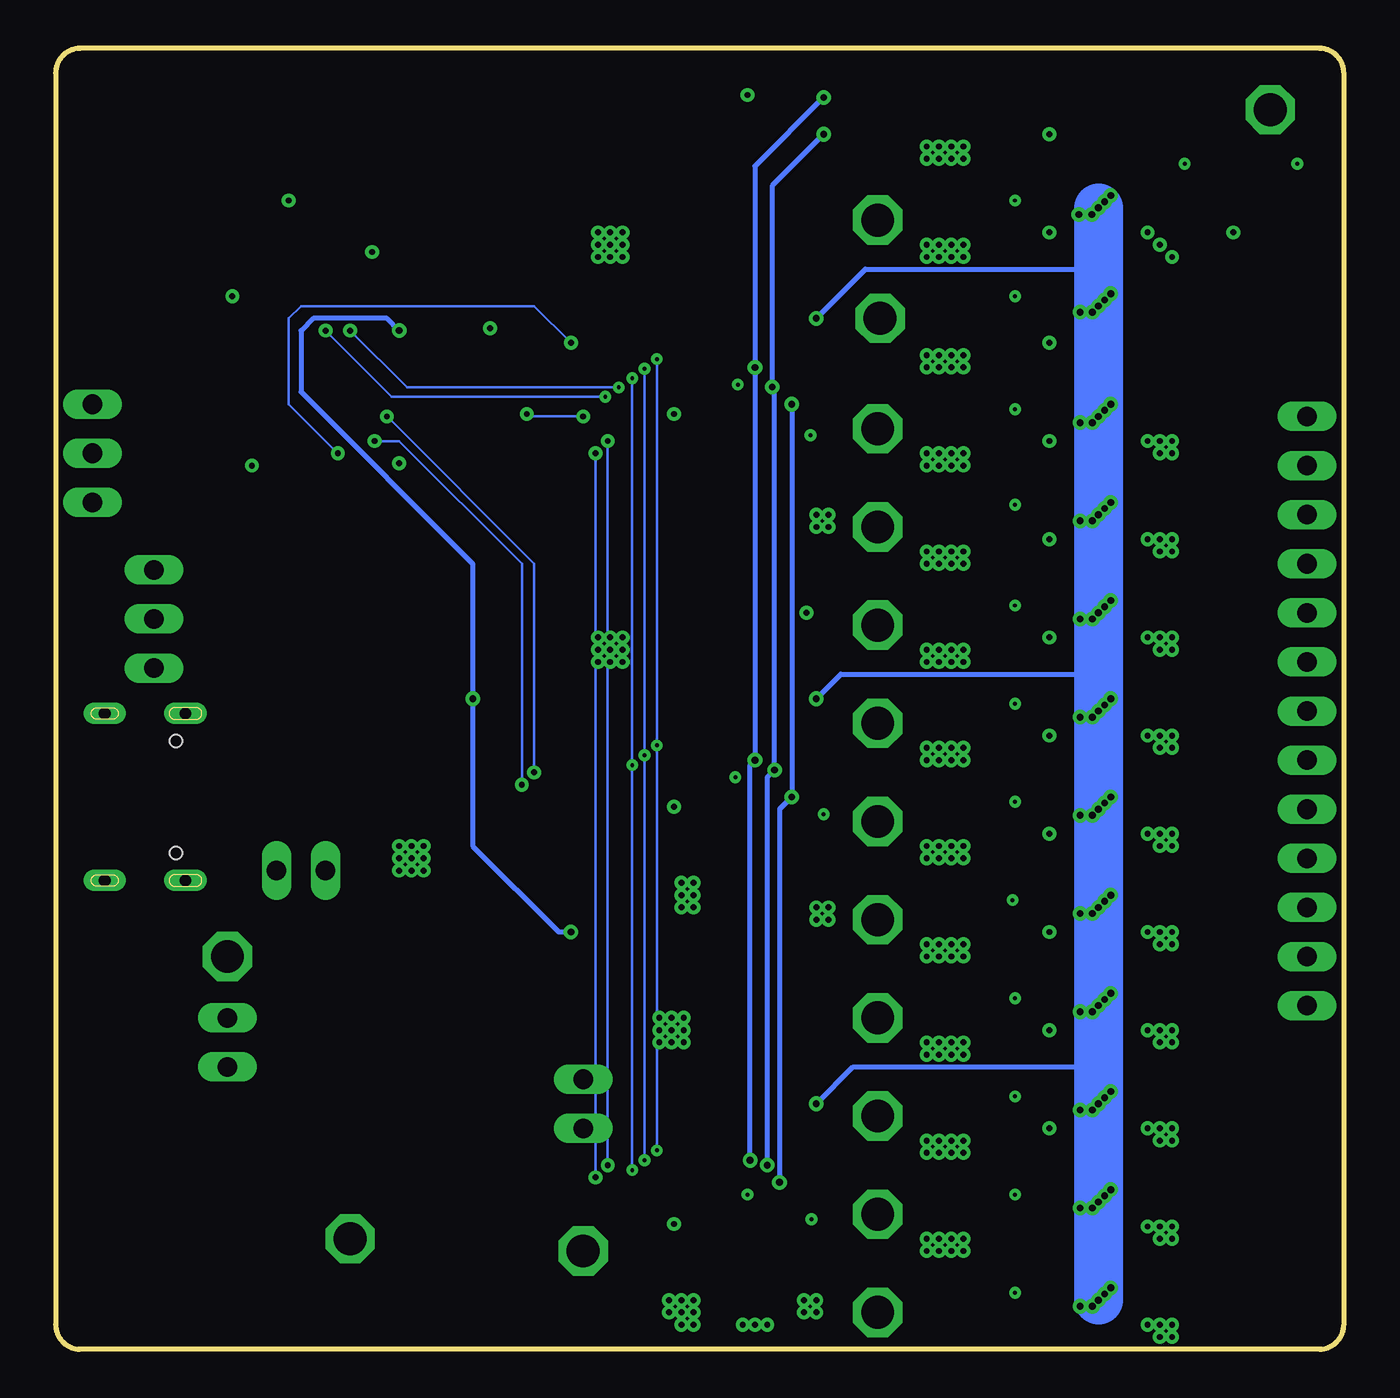
[diagram p5: board, bottom side, seen from below]

Size 66.68 x 67.31 mm. Coordinates in mm from the lower left corner, seen from the top.
Outline: 0,66.04 0,1.27 arc90 1.27,0 65.41,0 arc90 66.68,1.27 66.68,66.04 arc90 65.41,67.31 1.27,67.31 arc90 0,66.04
Copper layers (1+2*15+16): Top 0.035mm / dielectric 1.5mm / Route2 0.035mm / dielectric 0.15mm / Route15 0.035mm / dielectric 0.2mm / Bottom 0.035mm
Design rules "default *": minimum track width 3.5mil, minimum drill 0.2mm, track to track 3.5mil, track to pad 3.5mil, pad to pad 3.5mil, via to via 3.5mil, smd to smd 0mil, copper to edge 0.1mm, drill to drill 10mil, minimum pad ring 10mil, minimum via ring 8mil, stop-mask expansion 4mil, vias tented up to drill 0mil, thermal gap 10mil

### Footprints (pad centres in the part's own frame; a part is rotated, then mirrored left to right if it is on the bottom)
C0603 = smd 1.1 x 1: 1 -0.85,0; 2 0.85,0
DO214AA = smd 1.8 x 2.2: A 2.55,0; C -2.55,0
TO252 = smd 1 x 1.6: 1 -2.28,-4.8; 2 2.28,-4.8 | smd 5.4 x 6.2: 3 0,2.5
SOT223 = smd 1.219 x 2.235: 1 -2.311,-3.099; 2 0,-3.099; 3 2.311,-3.099 | smd 3.6 x 2.2: 4 0,3.099
AMPHENOL_12402012E212A = smd 0.6 x 1.14: A1_B12 -3.2,4.75; A4_B9 -2.4,4.75; B1_A12 3.2,4.75; B4_A9 2.4,4.75 | smd 0.3 x 1.14: A5 -1.25,4.75; A6 -0.25,4.75; A7 0.25,4.75; A8 1.25,4.75; B5 1.75,4.75; B6 0.75,4.75; B7 -0.75,4.75; B8 -1.75,4.75 | drill 0.6 pad 1.05 long: SH1 -4.32,4.18; SH2 4.32,4.18 | drill 0.6 pad 0.9 long: SH3 -4.32,0; SH4 4.32,0 | hole 0.65: 2.89,3.68; -2.89,3.68
1X13 = drill 1.016 long: 1 -15.24,0; 2 -12.7,0; 3 -10.16,0; 4 -7.62,0; 5 -5.08,0; 6 -2.54,0; 7 0,0; 8 2.54,0; 9 5.08,0; 10 7.62,0; 11 10.16,0; 12 12.7,0; 13 15.24,0
1X02 = drill 1.016 long: 1 -1.27,0; 2 1.27,0
1X03 = drill 1.016 long: 1 -2.54,0; 2 0,0; 3 2.54,0
SML1206 = smd 1.5 x 1.5: A 1.75,0; C -1.75,0
R0603 = smd 1 x 1.1: 1 -0.85,0; 2 0.85,0
P1-17 = drill 1.702 pad 2.54 octagon: TP 0,0
SOP65P490X110-8N = smd 1.47 x 0.48: 1 -2.15,0.975; 2 -2.15,0.325; 3 -2.15,-0.325; 4 -2.15,-0.975; 5 2.15,-0.975; 6 2.15,-0.325; 7 2.15,0.325; 8 2.15,0.975
QFP50P700X700X120-32N = smd 1.44 x 0.26: 1 -3.195,1.75; 2 -3.195,1.25; 3 -3.195,0.75; 4 -3.195,0.25; 5 -3.195,-0.25; 6 -3.195,-0.75; 7 -3.195,-1.25; 8 -3.195,-1.75; 17 3.195,-1.75; 18 3.195,-1.25; 19 3.195,-0.75; 20 3.195,-0.25; 21 3.195,0.25; 22 3.195,0.75; 23 3.195,1.25; 24 3.195,1.75 | smd 0.26 x 1.44: 9 -1.75,-3.195; 10 -1.25,-3.195; 11 -0.75,-3.195; 12 -0.25,-3.195; 13 0.25,-3.195; 14 0.75,-3.195; 15 1.25,-3.195; 16 1.75,-3.195; 25 1.75,3.195; 26 1.25,3.195; 27 0.75,3.195; 28 0.25,3.195; 29 -0.25,3.195; 30 -0.75,3.195; 31 -1.25,3.195; 32 -1.75,3.195
SOT95P280X145-5N = smd 1.21 x 0.59: 1 -1.255,0.95; 2 -1.255,0; 3 -1.255,-0.95; 4 1.255,-0.95; 5 1.255,0.95
QFP50P1200X1200X160-64N = smd 1.5 x 0.3: 1 -5.7,3.75; 2 -5.7,3.25; 3 -5.7,2.75; 4 -5.7,2.25; 5 -5.7,1.75; 6 -5.7,1.25; 7 -5.7,0.75; 8 -5.7,0.25; 9 -5.7,-0.25; 10 -5.7,-0.75; 11 -5.7,-1.25; 12 -5.7,-1.75; 13 -5.7,-2.25; 14 -5.7,-2.75; 15 -5.7,-3.25; 16 -5.7,-3.75; 33 5.7,-3.75; 34 5.7,-3.25; 35 5.7,-2.75; 36 5.7,-2.25; 37 5.7,-1.75; 38 5.7,-1.25; 39 5.7,-0.75; 40 5.7,-0.25; 41 5.7,0.25; 42 5.7,0.75; 43 5.7,1.25; 44 5.7,1.75; 45 5.7,2.25; 46 5.7,2.75; 47 5.7,3.25; 48 5.7,3.75 | smd 0.3 x 1.5: 17 -3.75,-5.7; 18 -3.25,-5.7; 19 -2.75,-5.7; 20 -2.25,-5.7; 21 -1.75,-5.7; 22 -1.25,-5.7; 23 -0.75,-5.7; 24 -0.25,-5.7; 25 0.25,-5.7; 26 0.75,-5.7; 27 1.25,-5.7; 28 1.75,-5.7; 29 2.25,-5.7; 30 2.75,-5.7; 31 3.25,-5.7; 32 3.75,-5.7; 49 3.75,5.7; 50 3.25,5.7; 51 2.75,5.7; 52 2.25,5.7; 53 1.75,5.7; 54 1.25,5.7; 55 0.75,5.7; 56 0.25,5.7; 57 -0.25,5.7; 58 -0.75,5.7; 59 -1.25,5.7; 60 -1.75,5.7; 61 -2.25,5.7; 62 -2.75,5.7; 63 -3.25,5.7; 64 -3.75,5.7
OSCCC500X320X110-4N = smd 1.9 x 1.4: 1 -2.2,-1.2; 2 2.2,-1.2; 3 2.2,1.2; 4 -2.2,1.2

### Placement (x,y rotation side)
C1  16.51,60.96 90 top
C2  17.4,58.42 0 top
C3  20.83,60.2 180 top
C4  16.51,55.88 90 top
C5  17.4,53.34 0 top
C6  20.83,55.12 180 top
C7  16.51,50.16 90 top
C8  17.4,47.62 0 top
C9  20.83,49.4 180 top
C10  16.51,45.08 90 top
C11  17.4,42.55 0 top
C12  20.83,44.32 180 top
C13  16.51,40 90 top
C14  17.4,37.47 0 top
C15  20.83,39.24 180 top
C16  16.51,34.92 90 top
C17  17.4,32.39 0 top
C18  20.83,34.16 180 top
C19  16.51,29.84 90 top
C20  17.4,27.3 0 top
C21  20.83,29.08 180 top
C22  16.51,24.76 90 top
C23  17.4,22.22 0 top
C24  20.83,24 180 top
C25  16.51,19.68 90 top
C26  17.4,17.14 0 top
C27  20.83,18.92 180 top
C28  16.51,14.6 90 top
C29  17.4,12.06 0 top
C30  20.83,13.84 180 top
C31  16.51,9.52 90 top
C32  17.4,6.98 0 top
C33  20.83,8.76 180 top
C34  16.51,4.44 90 top
C35  17.4,1.9 0 top
C36  20.83,3.68 180 top
C37  27.24,45.4 90 top
C38  33.72,46.42 90 top
C39  31.31,44.64 90 top
C40  29.65,44.64 90 top
C41  28.64,57.47 90 top
C42  27.18,25.08 90 top
C43  33.34,26.35 90 top
C44  31.18,24.64 90 top
C45  29.46,23.94 90 top
C46  28.57,37.47 90 top
C47  27.56,4.7 90 top
C48  33.53,5.33 90 top
C49  31.5,3.43 90 top
C50  29.97,3.43 90 top
C51  28.83,16.26 90 top
C52  6.98,62.23 180 top
C53  3.17,58.42 0 top
C54  49.53,12.06 270 top
C55  41.91,12.06 270 top
C56  54.61,15.24 90 top
C57  52.07,15.24 90 top
C58  45.34,16.76 180 top
C59  45.47,19.05 180 top
C60  60.96,55.24 0 top
C61  57.79,42.23 0 top
C62  56.2,57.78 90 top
C63  60.96,53.66 0 top
C64  45.4,53.66 90 top
C65  47.05,43.88 270 top
C66  47.62,57.78 90 top
C67  49.21,57.78 90 top
C68  31.43,40 90 top
C69  31.43,36.83 270 top
C70  31.75,19.05 90 top
C71  31.75,15.87 270 top
C72  31.43,60.01 90 top
C73  31.43,56.83 270 top
D1  55.24,11.43 0 top
IC1  45.72,8.25 180 top
IC2  51.43,19.05 270 top
J1  64.14,28.57 90 top
JP1  1.9,33.02 90 top
JP2  57.79,15.87 270 top
JP3  64.77,46.36 90 top
JP4  61.59,37.78 90 top
JP5  39.37,12.7 90 top
JP6  53.97,24.76 180 top
LED1  55.24,8.89 180 top
LED2  41.66,4.44 90 top
LED3  42.54,17.14 90 top
LED4  40.64,39.69 90 top
LED5  42.86,39.69 90 top
LED6  45.09,39.69 90 top
R1  12.7,62.23 180 top
R2  20.95,58.42 0 top
R3  18.29,60.96 270 top
R4  12.7,57.15 180 top
R5  20.95,53.34 0 top
R6  18.29,55.88 270 top
R7  12.7,51.43 180 top
R8  20.95,47.62 0 top
R9  18.29,50.16 270 top
R10  12.7,46.36 180 top
R11  20.95,42.55 0 top
R12  18.29,45.08 270 top
R13  12.7,41.27 180 top
R14  20.95,37.47 0 top
R15  18.29,40 270 top
R16  12.7,36.19 180 top
R17  20.95,32.39 0 top
R18  18.29,34.92 270 top
R19  12.7,31.11 180 top
R20  20.95,27.3 0 top
R21  18.29,29.84 270 top
R22  12.7,26.04 180 top
R23  20.95,22.22 0 top
R24  18.29,24.76 270 top
R25  12.7,20.96 180 top
R26  20.95,17.14 0 top
R27  18.29,19.68 270 top
R28  12.7,15.87 180 top
R29  20.95,12.06 0 top
R30  18.29,14.6 270 top
R31  12.7,10.79 180 top
R32  20.95,6.98 0 top
R33  18.29,9.52 270 top
R34  12.7,5.71 180 top
R35  20.95,1.9 0 top
R36  18.29,4.44 270 top
R37  28.57,64.77 0 top
R38  28.57,62.86 0 top
R39  28.57,60.96 0 top
R40  25.4,64.77 0 top
R41  25.4,62.86 0 top
R42  25.4,60.96 0 top
R43  3.17,60.32 180 top
R44  3.17,56.52 0 top
R45  62.23,51.43 180 top
R46  53.34,58.42 270 top
R47  50.8,8.89 180 top
R48  41.91,8.89 90 top
R49  45.09,20.96 0 top
R50  40.64,44.13 90 top
R51  42.86,44.13 90 top
R52  45.02,44.13 90 top
R53  57.79,31.75 90 top
R54  57.79,26.04 90 top
R55  39.37,54.61 180 top
R56  42.54,33.66 180 top
R57  38.73,19.68 270 top
TP1  51.43,5.71 0 top
TP2  39.37,5.08 0 top
TP3  57.79,20.32 0 top
TP4  24.13,58.42 0 top
TP5  24,53.34 0 top
TP6  24.13,47.62 0 top
TP7  24.13,42.55 0 top
TP8  24.13,37.47 0 top
TP9  24.13,32.39 0 top
TP10  24.13,27.3 0 top
TP11  24.13,22.22 0 top
TP12  24.13,17.14 0 top
TP13  24.13,12.06 0 top
TP14  24.13,6.98 0 top
TP15  24.13,1.9 0 top
TP16  3.81,64.13 0 top
U1  12.7,59.69 0 top
U2  12.7,54.61 0 top
U3  12.7,48.89 0 top
U4  12.7,43.81 0 top
U5  12.7,38.73 0 top
U6  12.7,33.66 0 top
U7  12.7,28.57 0 top
U8  12.7,23.5 0 top
U9  12.7,18.41 0 top
U10  12.7,13.33 0 top
U11  12.7,8.25 0 top
U12  12.7,3.17 0 top
U13  30.16,50.48 0 top
U14  30.16,30.48 0 top
U15  30.48,9.52 0 top
U16  6.98,59.69 0 top
U17  52.7,49.53 270 top
Y1  34.61,57.47 90 top
Y2  34.61,37.47 90 top
Y3  34.92,16.51 90 top

### Tracks (layer width: path | path; a pad name or v marks a point on that pad's centre or on a via)
2V5  (via drill 0.35)
  Top 0.127: JP1.13 1.9,52.7 7.94,58.74 U16.4
  Top 0.152: TP16.TP 3.81,62.23 5.4,60.64 U16.1
  Top 0.254: U15.7 28.21,8.27 28.32,8.38 28.32,9.27 | 28.32,9.27 28.32,10.29 | 28.32,10.29 28.32,11.43 | U15.1 28.17,11.27 28.32,11.43 | U15.3 28.31,10.27 28.32,10.29 | U15.5 28.32,9.27 | U13.7 27.77,49.23 28,49.47 28,50.23 | 28,50.23 28,51.24 | 28,51.24 28,52.13 | U13.1 27.9,52.23 28,52.13 | U13.3 27.99,51.23 28,51.24 | U13.5 28,50.23 | U14.7 27.77,29.23 28,29.46 28,30.23 | 28,30.23 28,31.24 | 28,31.24 28,32.26 | U14.1 27.97,32.23 28,32.26 | U14.3 27.99,31.23 28,31.24 | U14.5 28,30.23 | U16.1 7.05,60.64 8.26,59.44 U16.4 | U16.4 | U16.4 8.57,58.74 8.89,59.05 8.89,59.69 9.21,60.02 U1.2 | v27.3,53.34 28,52.64 28,52.13 | 28,32.26 28,32.96 v27.3,33.66 | 28.32,11.43 28.32,11.68 v27.3,12.7
  Top 0.381: U2.2 11.74,54.93 v12.06,54.61 v12.38,54.29 v12.7,53.97 v13.02,53.66 v13.65,53.66 13.67,53.63 U2.5 | U1.2 11.74,60.02 v12.06,59.69 v12.38,59.37 v12.7,59.05 v13.04,58.71 v13.72,58.71 U1.5 | U3.2 11.74,49.22 v12.06,48.89 v12.38,48.58 v12.7,48.26 v13.02,47.94 v13.65,47.94 13.67,47.92 U3.5 | U4.2 11.74,44.14 v12.06,43.81 v12.38,43.5 v12.7,43.18 v13.02,42.86 13.04,42.84 13.63,42.84 v13.65,42.86 13.67,42.84 U4.5 | U5.2 11.74,39.06 v12.06,38.73 v12.38,38.42 v12.7,38.1 v13.02,37.78 v13.65,37.78 13.67,37.76 U5.5 | U6.2 11.74,33.98 v12.06,33.66 v12.38,33.34 v12.7,33.02 v13.02,32.7 13.04,32.68 13.63,32.68 v13.65,32.7 13.67,32.68 U6.5 | U7.2 11.74,28.9 v12.06,28.57 v12.38,28.26 v12.7,27.94 v13.02,27.62 v13.65,27.62 13.67,27.6 U7.5 | U8.2 11.74,23.82 v12.06,23.5 v12.38,23.18 v12.7,22.86 v13.02,22.54 v13.65,22.54 13.67,22.52 U8.5 | U9.2 11.74,18.74 v12.06,18.41 v12.38,18.1 v12.7,17.78 v13.02,17.46 v13.65,17.46 13.67,17.44 U9.5 | U10.2 11.74,13.66 v12.06,13.33 v12.38,13.02 v12.7,12.7 v13.02,12.38 v13.65,12.38 13.67,12.36 U10.5 | U11.2 11.74,8.58 v12.06,8.25 v12.38,7.94 v12.7,7.62 v13.02,7.3 v13.65,7.3 13.67,7.28 U11.5 | U12.2 11.74,3.5 v12.06,3.17 v12.38,2.86 v12.7,2.54 v13.02,2.22 v13.65,2.22 13.67,2.2 U12.5
  Bottom 0.254: v27.3,53.34 24.77,55.88 12.7,55.88 | v27.3,12.7 25.4,14.6 12.7,14.6 | v27.3,33.66 26.03,34.92 12.7,34.92
  Bottom 2.54: v12.7,59.05 12.7,55.88 v12.7,53.97 v12.7,48.26 v12.7,43.18 v12.7,38.1 12.7,34.92 v12.7,33.02 v12.7,27.94 v12.7,22.86 v12.7,17.78 12.7,14.6 v12.7,12.7 v12.7,7.62 v12.7,2.54
3V3  (via drill 0.3 pad 0.61)
  Top 0.254: U15.29 30.23,11.68 31.73,10.18 U15.15 U15.16 32.38,6.18 C48.2 | C48.2 33.53,7.63 U15.17 | C61.1 56.45,41.87 U17.48 56.45,45.66 v56.51,45.72 | C62.1 56.45,56.68 U17.1 56.78,55.23 v57.53,54.48 58.42,53.59 58.42,53.28 | 58.42,53.28 59.73,53.28 C63.1 C60.1 | 58.42,53.28 U17.64 | C66.1 C67.1 50.02,56.93 50.45,56.5 | U17.13 50.45,56.5 | U17.19 45.83,52.28 45.72,52.39 45.72,52.49 C64.1 45.38,52.83 v44.2,52.83 | 33.34,27.3 C43.2 31.99,27.2 U14.16 U14.15 31.41,28.17 32.3,29.06 32.3,29.93 29.91,32.32 U14.29 | 33.34,27.3 33.34,28.71 U14.17 | C38.2 31.93,47.27 U13.16 U13.15 31.41,48.56 32.05,49.19 32.05,50.5 29.91,52.64 U13.29 | U13.17 33.36,47.63 C38.2 | C65.1 47,44.78 47,45.72 | 47,45.72 U17.32 | R39.2 R38.2 R37.2 30.73,64.77 v30.86,64.9 | v48.89,45.85 48.77,45.72 47,45.72 | v50.29,56.77 50.45,56.61 50.45,56.5 | v54.61,59.44 53.51,59.44 R46.1 | C38.2 34.67,48.22 v34.67,48.39 | v34.67,28.07 34.67,27.43 34.54,27.3 33.34,27.3 | v34.67,6.48 34.38,6.18 C48.2 | TP3.TP 55.24,22.86 JP6.1 55.24,25.4 53.34,27.3 52.07,27.3 50.8,26.04 50.8,24.13 49.53,22.86 46.99,22.86 45.93,21.8 R49.2 46.32,20.57 C59.1
  pour Route2: 33.65,-8.26 33.65,-4.45 33.02,-3.81 33.02,9.52 29.21,13.33 29.21,19.68 30.48,20.96 33.02,23.5 33.02,24.76 33.02,29.84 29.21,33.66 29.21,39.37 32.38,42.55 33.02,43.18 33.02,44.45 33.02,50.16 30.48,52.7 29.21,53.97 29.21,57.78 29.21,69.21 33.65,73.66 41.27,81.28 50.16,81.28 85.73,81.28 88.27,78.74 99.06,67.94 99.06,20.32 99.06,7.62 89.54,-1.91 81.28,-10.16 35.56,-10.16
5V  (via drill 0.2 pad 0.46)
  Top 0.254: C52.1 8.24,61.82 v8.24,61.34 U16.5 | C42.2 27.3,26.06 27.3,27.05 27.43,27.18 | 27.43,27.18 27.54,27.29 U14.9 | C37.2 27.3,46.32 27.3,46.99 v27.6,47.29 U13.9 | R43.2 2.32,61.25 v2.41,61.34 | C4.1 17.02,54.52 v17.02,54.48 | C1.1 17.02,59.6 v17.02,59.44 | C7.1 17.02,48.81 v17.02,48.64 | C10.1 17.02,43.73 v17.02,43.69 | C13.1 17.02,38.65 v17.02,38.48 | C16.1 17.02,33.57 v17.02,33.4 | C19.1 17.02,28.49 v17.02,28.32 | C22.1 17.02,23.41 17.02,23.24 v17.14,23.24 | C25.1 17.02,18.33 v17.02,18.16 | C28.1 17.02,13.25 v17.02,13.08 | C31.1 17.02,8.17 v17.02,8 | C34.1 17.02,3.09 v17.02,2.92 | R48.2 40.85,9.74 | 40.85,9.74 39.37,8.25 TP2.TP 34.92,0.63 29.21,0.63 28.73,1.11 U15.9 28.34,6.33 C47.2 v27.56,6.73 | v26.92,27.69 27.43,27.18 | C55.1 40.42,11.43 JP5.1 40,11.43 40.85,10.58 40.85,9.74
  Top 0.381: U1.7 16.41,60.02 C1.1 | C4.1 16.41,54.93 U2.7 | C7.1 16.41,49.22 U3.7 | C10.1 16.41,44.14 U4.7 | C13.1 16.41,39.06 U5.7 | C16.1 16.41,33.98 U6.7 | C19.1 16.41,28.9 U7.7 | C22.1 16.41,23.82 U8.7 | C25.1 16.41,18.74 U9.7 | C28.1 16.41,13.66 U10.7 | C31.1 16.41,8.58 U11.7 | C34.1 16.41,3.5 U12.7
  pour Route2: 28.57,0 28.57,76.83 21.59,83.82 -17.78,83.82 -22.86,78.74 -22.86,-16.51 -14.61,-24.77 25.4,-24.77 27.94,-22.23 28.57,-21.59
9V
  Top 0.254: TP1.TP 50.15,6.99 50.15,8.89
  Top 0.381: C58.1 48.31,16.76 IC2.3 48.34,13.39 IC1.1 48.14,12.91 C54.1 51,14.39 C57.1 52.7,14.39 | C56.1 52.7,14.39 | 52.7,14.39 52.7,14.38 D1.C 50.15,8.89 R47.2
ADC0
  Top 0.254: R2.2 TP4.TP 25.91,56.64 25.91,51.94 26.12,51.73 U13.2
  Top 0.381: C3.1 21.68,58.55 R2.2
ADC0_CS  (via drill 0.3 pad 0.61)
  Top 0.127: U13.23 39.67,51.73 v40,52.07 | v52.07,46.36 50.95,45.24 U17.37
  Bottom 0.127: v40,52.07 41.91,53.97 53.97,53.97 54.61,53.34 54.61,48.89 v52.07,46.36
ADC0_DONE  (via drill 0.2 pad 0.46, 0.3 pad 0.61)
  Top 0.127: U13.18 38.18,49.23 v38.23,49.28 | v52.7,52.7 52.95,52.95 U17.8
  Bottom 0.127: v38.23,49.28 49.28,49.28 v52.7,52.7
ADC0_DRDY  (via drill 0.2 pad 0.46, 0.3 pad 0.61)
  Top 0.127: U13.19 37.54,49.73 37.54,49.75 v37.53,49.76 | v51.43,52.7 52.45,53.72 U17.9
  Bottom 0.127: v37.53,49.76 48.49,49.76 v51.43,52.7
ADC1
  Top 0.254: U13.4 24.71,50.73 24,51.43 TP5.TP R5.2
  Top 0.381: C6.1 21.8,54.99 R5.2
ADC1_CS
  Top 0.127: U14.23 50.14,31.73 51.43,33.02 51.43,43.81 U17.38
ADC1_DONE  (via drill 0.3 pad 0.61)
  Top 0.127: U14.18 42.52,29.23 v42.54,29.21 | v50.16,46.99 50.16,52.32 51.95,54.11 U17.10
  Bottom 0.127: v42.54,29.21 42.54,40.64 48.89,46.99 v50.16,46.99
ADC1_DRDY  (via drill 0.3 pad 0.61)
  Top 0.127: U14.19 41.79,29.73 v41.91,29.84 | U17.11 51.45,54.25 49.53,52.32 v49.53,48.26
  Bottom 0.127: v41.91,29.84 41.91,40.64 v49.53,48.26
ADC2
  Top 0.254: U13.6 24.33,49.73 24.13,49.53 TP6.TP R8.2
  Top 0.381: C9.1 21.8,49.28 R8.2
ADC2_CS
  Top 0.127: U15.23 33.7,10.79 35.56,10.79 37.46,12.7 37.46,14.6 41.27,18.41 41.27,21.59 51.95,32.27 U17.39
ADC2_DONE  (via drill 0.3 pad 0.61)
  Top 0.127: U15.18 38.12,8.27 v38.73,8.89 | U17.24 42.16,49.78 v38.73,46.36
  Bottom 0.127: v38.73,8.89 v38.73,46.36
ADC2_DRDY  (via drill 0.3 pad 0.61)
  Top 0.127: U15.19 37.35,8.77 v38.1,9.52 | v38.1,46.99 v39.37,48.26 | v42.29,48.39 43.18,49.28 U17.25
  Bottom 0.127: v38.1,9.52 v38.1,46.99 | v42.29,48.39 42.16,48.26 v39.37,48.26
ADC3
  Top 0.254: U13.8 26.38,48.73 26.03,48.39 26.03,44.45 TP7.TP R11.2
  Top 0.381: C12.1 21.8,44.2 R11.2
ADC4
  Top 0.254: U14.2 26.05,31.73 25.78,32 25.78,35.81 TP8.TP R14.2
  Top 0.381: C15.1 21.8,39.12 R14.2
ADC5
  Top 0.254: U14.4 25.78,30.73 TP9.TP R17.2
  Top 0.381: C18.1 21.8,34.04 R17.2
ADC6
  Top 0.254: U14.6 24.65,29.73 24.13,29.21 TP10.TP R20.2
  Top 0.381: C21.1 21.8,28.96 R20.2
ADC7
  Top 0.254: U14.8 26.44,28.73 26.03,28.32 26.03,24.13 TP11.TP R23.2
  Top 0.381: C24.1 21.8,23.88 R23.2
ADC8
  Top 0.254: U15.2 26.44,10.77 26.03,11.18 26.03,15.24 TP12.TP R26.2
  Top 0.381: C27.1 21.8,18.8 R26.2
ADC9
  Top 0.254: U15.4 26.42,9.77 TP13.TP R29.2
  Top 0.381: C30.1 21.8,13.72 R29.2
ADC10
  Top 0.254: U15.6 25.92,8.77 TP14.TP R32.2
  Top 0.381: C33.1 21.8,8.64 R32.2
ADC11
  Top 0.254: U15.8 26.7,7.77 26.42,7.49 26.42,4.19 TP15.TP R35.2
  Top 0.381: C36.1 21.8,3.56 R35.2
ADC_CLK  (via drill 0.35)
  Top 0.254: U17.15 49.45,54.15 49.15,53.85 48.89,53.85 | 48.89,53.85 48.39,53.85 46.48,55.75 41.36,55.75 R55.1 | 48.89,53.85 v48.89,52.7 | v45.09,33.66 R56.1 | v40,21.59 38.95,20.54 R57.1
  Bottom 0.254: v48.89,52.7 49.53,53.34 53.34,53.34 53.97,52.7 53.97,49.53 45.09,40.64 v45.09,33.66 45.09,26.04 40.64,21.59 v40,21.59
ADC_DIN  (via drill 0.2 pad 0.46)
  Top 0.127: U13.20 v36.83,50.23 46.96,50.23 U17.23 | U15.20 v36.83,9.27 | U14.20 v36.83,30.23
  Bottom 0.127: v36.83,50.23 v36.83,30.23 v36.83,9.27
ADC_DOUT  (via drill 0.2 pad 0.46)
  Top 0.127: U13.21 v36.2,50.73 46.96,50.73 U17.22 | U15.21 v36.19,9.77 v36.2,9.78 | U14.21 v36.19,30.73 v36.2,30.73
  Bottom 0.127: v36.2,50.73 v36.2,30.73 v36.2,9.78
ADC_MODE_0  (via drill 0.35)
  Top 0.254: U13.30 29.41,51.87 v30.48,50.8 | U14.30 29.41,31.55 v30.48,30.48 | U15.30 29.73,10.78 v30.73,9.78 | R40.2 v26.92,64.77 R37.1
  Bottom 0.254: v30.73,9.78 30.73,30.23 v30.48,30.48 v30.48,50.8 30.48,61.21 v26.92,64.77
ADC_MODE_1  (via drill 0.35)
  Top 0.254: U13.31 28.91,50.46 v29.59,49.78 | U14.31 28.91,30.52 v29.46,29.97 | U15.31 29.23,10.14 v29.84,9.52 | R38.1 v26.92,62.86 R41.2
  Bottom 0.254: v29.84,9.52 29.84,29.59 v29.46,29.97 29.46,49.66 v29.59,49.78 29.59,60.2 v26.92,62.86
ADC_MODE_2  (via drill 0.35)
  Top 0.254: v28.57,48.89 28.41,49.06 U13.32 28.41,54.95 27.72,55.63 R39.1 R42.2 | U14.32 28.41,28.74 v28.57,28.57 | U15.32 28.73,9.12 v29.21,8.64
  Bottom 0.254: v28.57,48.89 v28.57,28.57 29.21,27.94 v29.21,8.64
ADC_SCLK  (via drill 0.2 pad 0.46)
  Top 0.127: U13.22 v35.56,51.23 46.96,51.23 U17.21 | U15.22 35.55,10.27 v35.56,10.29 | U14.22 v35.55,31.23 v35.56,31.24
  Bottom 0.127: v35.56,51.23 v35.56,31.24 v35.56,10.29
GND  (via drill 0.2 pad 0.46, 0.3 pad 0.61)
  Top 0.254: R42.1 R41.1 R40.1 24.55,65.82 24.77,66.04 34.92,66.04 35.81,65.16 Y1.2 | C49.1 33.62,2.58 v33.65,2.54 33.65,4.36 C48.1 | v27.81,38.1 28.03,38.31 C46.2 | U14.11 29.41,28.14 29.84,28.57 30.48,28.57 30.41,28.51 U14.13 | U13.11 29.41,48.46 29.84,48.89 30.48,48.89 30.41,48.83 U13.13 | U15.11 29.73,7.5 29.84,7.62 30.48,7.62 30.73,7.37 U15.13 | C45.1 30.16,23.79 C44.1 | J1.A1_B12 59.95,24.8 J1.SH1 | J1.B1_A12 59.95,32.34 J1.SH2
  other vias: 30.86,8 31.5,29.59 31.37,49.91 19.69,57.15 20.32,57.15 20.95,57.15 21.59,57.15 20.95,56.52 21.59,56.52 20.32,56.52 19.69,56.52 19.69,51.43 19.69,50.8 20.32,51.43 20.95,51.43 21.59,51.43 21.59,50.8 20.95,50.8 20.32,50.8 19.69,45.72 20.32,45.72 20.95,45.72 21.59,45.72 21.59,46.36 20.95,46.36 20.32,46.36 19.69,46.36 19.69,40.64 19.69,41.27 20.32,41.27 20.95,41.27 21.59,41.27 21.59,40.64 20.95,40.64 20.32,40.64 19.69,35.56 19.69,36.19 20.32,36.19 20.32,35.56 20.95,35.56 20.95,36.19 21.59,36.19 21.59,35.56 19.69,30.48 19.69,31.11 20.32,31.11 20.32,30.48 20.95,30.48 20.95,31.11 21.59,31.11 21.59,30.48 19.69,26.04 19.69,25.4 20.32,25.4 20.32,26.04 20.95,26.04 20.95,25.4 21.59,25.4 21.59,26.04 19.69,20.96 19.69,20.32 20.32,20.32 20.95,20.32 21.59,20.32 21.59,20.96 20.95,20.96 20.32,20.96 19.69,15.87 19.69,15.24 20.32,15.24 20.32,15.87 20.95,15.87 20.95,15.24 21.59,15.24 21.59,15.87 19.69,10.79 19.69,10.16 20.32,10.16 20.32,10.79 20.95,10.79 20.95,10.16 21.59,10.16 21.59,10.79 19.69,5.08 19.69,5.71 20.32,5.71 20.32,5.08 20.95,5.08 20.95,5.71 21.59,5.71 21.59,5.08 15.24,11.43 15.24,16.51 15.24,21.59 15.24,26.67 15.24,31.75 15.24,36.83 15.24,41.91 15.24,46.99 15.24,52.07 15.24,57.78 19.69,61.59 20.32,61.59 20.95,61.59 21.59,61.59 21.59,62.23 19.69,62.23 20.32,62.23 20.95,62.23 15.24,62.86 10.16,57.78 9.53,57.15 8.89,56.52 10.16,46.99 9.53,46.36 9.53,46.99 8.89,46.99 8.89,46.36 10.16,41.91 9.53,41.91 8.89,41.91 8.89,41.27 9.53,41.27 10.16,36.83 9.53,36.83 8.89,36.83 8.89,36.19 9.53,36.19 10.16,31.75 9.53,31.75 8.89,31.75 8.89,31.11 9.53,31.11 10.16,26.67 9.53,26.67 8.89,26.67 8.89,26.04 9.53,26.04 10.16,21.59 9.53,21.59 8.89,21.59 8.89,20.96 9.53,20.96 10.16,16.51 9.53,16.51 8.89,16.51 8.89,15.87 9.53,15.87 10.16,11.43 9.53,11.43 8.89,11.43 8.89,10.79 9.53,10.79 10.16,6.35 9.53,6.35 8.89,6.35 8.89,5.71 9.53,5.71 10.16,1.27 9.53,1.27 8.89,1.27 8.89,0.63 9.53,0.63 5.71,57.78 30.48,1.27 31.11,1.27 29.84,1.27 27.3,2.54 27.94,2.54 27.94,1.9 27.3,1.9 27.3,22.86 26.67,22.86 26.67,22.22 27.3,22.22 27.3,43.18 26.67,43.18 26.67,42.55 27.3,42.55 33.65,22.86 33.65,23.5 33.65,24.13 47.62,26.04 47.62,25.4 47.62,24.76 48.26,24.76 48.26,25.4 48.26,26.04 48.89,26.04 48.89,25.4 48.89,24.76 34.29,22.86 34.29,23.5 34.29,24.13 33.65,1.9 33.65,1.27 34.29,1.27 34.29,1.9 34.29,2.54 34.92,2.54 34.92,1.9 37.34,36.83 37.97,36.83 37.97,36.19 37.34,36.19 37.34,35.56 37.97,35.56 38.61,35.56 38.61,36.19 38.61,36.83 37.34,57.78 37.34,57.15 37.34,56.52 37.97,56.52 37.97,57.15 37.97,57.78 38.61,57.78 38.61,57.15 38.61,56.52 34.16,17.14 34.16,16.51 34.16,15.87 34.8,17.14 34.8,16.51 34.8,15.87 35.43,15.87 35.43,16.51 35.43,17.14
  pour Route15: 33.02,0.63 33.02,9.52 28.57,13.97 28.57,19.05 33.02,23.5 33.02,29.84 27.94,34.92 27.94,38.1 33.02,43.18 33.02,50.16 27.94,55.24 27.94,64.77 33.65,70.48 78.11,70.48 87,61.59 87,10.79 73.66,-2.54 36.2,-2.54
  pour Top (isolate 0.127): 35.56,-6.35 33.02,-3.81 33.02,9.52 28.57,13.97 28.57,19.05 33.02,23.5 33.02,29.84 27.94,34.92 27.94,38.1 33.02,43.18 33.02,50.16 27.94,55.24 27.94,64.77 41.91,78.74 81.28,78.74 92.08,67.94 92.08,17.78 67.95,-6.35
  pour Top: 31.75,-6.35 31.75,9.52 27.94,13.33 27.94,19.68 31.75,23.5 31.75,29.84 26.67,34.92 26.67,39.37 31.75,44.45 31.75,50.16 27.3,54.61 27.3,56.52 15.87,67.94 -5.72,67.94 -10.16,63.5 -10.16,-5.72 -5.08,-10.8 27.3,-10.8
  pour Route15: 31.75,-10.16 31.75,9.52 27.94,13.33 27.94,19.68 31.75,23.5 31.75,29.84 26.67,34.92 26.67,39.37 31.75,44.45 31.75,50.16 26.67,55.24 26.67,57.15 15.87,67.94 -5.72,67.94 -10.16,63.5 -10.16,-5.72 -1.91,-13.97 27.94,-13.97
LEAD0
  Top 0.127: JP1.12 3.81,45.72 4.44,46.36 4.44,53.34 9.53,58.42 9.53,59.18 9.71,59.36 U1.3
LEAD1
  Top 0.127: JP1.11 3.81,43.18 5.71,45.08 5.71,52.7 7.29,54.28 U2.3
LEAD2
  Top 0.127: JP1.10 3.81,40.64 6.98,43.81 6.98,47.62 7.93,48.57 U3.3
LEAD3
  Top 0.127: JP1.9 3.81,38.1 9.2,43.49 U4.3
LEAD4
  Top 0.127: U5.3 7.93,38.41 5.08,35.56 JP1.8
LEAD5
  Top 0.127: JP1.7 6.98,33.02 7.29,33.33 U6.3
LEAD6
  Top 0.127: JP1.6 3.81,30.48 6.04,28.25 U7.3
LEAD7
  Top 0.127: JP1.5 3.81,27.94 8.58,23.17 U8.3
LEAD8
  Top 0.127: JP1.4 3.81,25.4 8.26,20.96 8.26,19.05 9.21,18.09 U9.3
LEAD9
  Top 0.127: JP1.3 3.81,22.86 6.35,20.32 6.35,14.6 7.94,13.01 U10.3
LEAD10
  Top 0.127: JP1.2 3.81,20.32 4.44,19.68 4.44,11.43 7.94,7.93 U11.3
LEAD11
  Top 0.127: JP1.1 1.9,8.89 7.94,2.85 U12.3
LED0
  Top 0.254: R50.2 40.64,45.72 43.7,48.78 U17.26
LED1
  Top 0.254: R51.2 42.86,46.67 44.47,48.28 U17.27
LED2
  Top 0.254: R52.2 45.02,46.93 45.88,47.78 U17.28
N$1
  Top 0.381: R1.2 10.79,62.23 10.55,61.98 U1.1
N$2
  Top 0.381: R1.1 14.6,62.23 14.85,61.98 U1.8
N$3
  Top 0.381: U1.6 15.6,59.36 C2.1
N$4
  Top 0.381: R3.2 18.25,60.07 C2.2 R2.1
N$5
  Top 0.381: JP2.2 D1.A
N$6
  Top 0.254: U13.28 30.41,54.68 28.64,56.45 C41.1
N$7
  Top 0.254: Y1.3 32.22,60.86 C72.2 30.04,59.46 30.04,55.94 31.41,54.57 U13.26
N$8
  Top 0.254: C73.2 31.91,55.5 U13.25 34.63,53.68 35.81,54.86 35.81,55.24 | 35.81,55.24 Y1.1 | R55.2 36.44,54.61 35.81,55.24
N$9
  Top 0.254: C40.2 29.91,45.75 U13.12
N$10
  Top 0.254: C39.2 30.91,45.88 U13.14
N$11
  Top 0.381: R4.2 10.79,57.15 10.55,56.91 U2.1
N$12
  Top 0.381: U2.8 14.85,56.78 14.48,57.15 R4.1
N$13
  Top 0.381: U2.6 15.6,54.28 C5.1
N$14
  Top 0.381: R6.2 18.29,53.38 C5.2 R5.1
N$15
  Top 0.381: R7.2 10.79,51.43 10.55,51.19 U3.1
N$16
  Top 0.381: R7.1 14.6,51.43 14.85,51.19 U3.8
N$17
  Top 0.381: C8.1 15.6,48.57 U3.6
N$18
  Top 0.381: R8.1 C8.2 18.29,47.66 R9.2
N$19
  Top 0.381: R10.2 10.79,46.36 10.55,46.11 U4.1
N$20
  Top 0.381: R10.1 14.6,46.36 14.85,46.11 U4.8
N$21
  Top 0.381: C11.1 15.6,43.49 U4.6
N$22
  Top 0.381: R11.1 C11.2 18.29,42.58 R12.2
N$23
  Top 0.381: R13.2 10.79,41.27 10.55,41.03 U5.1
N$24
  Top 0.381: R13.1 14.6,41.27 14.85,41.03 U5.8
N$25
  Top 0.381: C14.1 15.6,38.41 U5.6
N$26
  Top 0.381: R14.1 C14.2 18.29,37.5 R15.2
N$27
  Top 0.381: R16.2 10.79,36.19 10.55,35.95 U6.1
N$28
  Top 0.381: R16.1 14.6,36.19 14.85,35.95 U6.8
N$29
  Top 0.381: C17.1 15.6,33.33 U6.6
N$30
  Top 0.381: R17.1 C17.2 18.25,34.04 R18.2
N$31
  Top 0.381: R19.2 10.79,31.11 10.55,30.87 U7.1
N$32
  Top 0.381: R19.1 14.6,31.11 14.85,30.87 U7.8
N$33
  Top 0.381: C20.1 15.6,28.25 U7.6
N$34
  Top 0.381: R20.1 C20.2 18.25,28.96 R21.2
N$35
  Top 0.381: R22.2 10.79,26.04 10.55,25.79 U8.1
N$36
  Top 0.381: R22.1 14.6,26.04 14.85,25.79 U8.8
N$37
  Top 0.381: C23.1 15.6,23.17 U8.6
N$38
  Top 0.381: R23.1 C23.2 18.29,22.26 R24.2
N$39
  Top 0.381: R25.2 10.79,20.96 10.55,20.71 U9.1
N$40
  Top 0.381: R25.1 14.6,20.96 14.85,20.71 U9.8
N$41
  Top 0.381: C26.1 15.6,18.09 U9.6
N$42
  Top 0.381: R26.1 C26.2 18.29,17.18 R27.2
N$43
  Top 0.254: 35.81,34.92 35.81,34.86 34.63,33.67 U14.25 31.91,35.5 C69.2 | 35.81,34.92 Y2.1 | R56.2 37.08,33.66 35.81,34.92
N$44
  Top 0.254: C46.1 28.57,36.51 30.41,34.67 U14.28
N$45
  Top 0.254: U14.14 30.91,25.75 C44.2
N$46
  Top 0.254: Y2.3 32.22,40.86 C68.2 30.04,39.46 30.04,35.94 31.41,34.56 U14.26
N$47
  Top 0.254: U14.12 29.91,25.24 C45.2
N$48
  Top 0.254: Y3.3 32.53,19.9 C70.2 31.71,19.9 30.35,18.54 30.35,14.99 31.73,13.61 U15.26
N$49
  Top 0.254: U15.28 30.73,13.59 28.92,15.41 C51.1
N$50
  Top 0.254: C49.2 31.23,4.54 U15.14
N$51
  Top 0.127: Y3.1 36.12,14.54 38.73,17.14 R57.2
  Top 0.254: Y3.1 36.12,13.9 34.95,12.72 U15.25 32.23,14.54 C71.2
N$52
  Top 0.254: C50.2 30.23,4.54 U15.12
N$53
  Top 0.381: R28.2 10.79,15.87 10.55,15.63 U10.1
N$54
  Top 0.381: R28.1 14.6,15.87 14.85,15.63 U10.8
N$55
  Top 0.381: C29.1 15.6,13.01 U10.6
N$56
  Top 0.381: R29.1 C29.2 18.29,12.1 R30.2
N$57
  Top 0.381: R31.2 10.79,10.79 10.55,10.55 U11.1
N$58
  Top 0.381: R31.1 14.6,10.79 14.85,10.55 U11.8
N$59
  Top 0.381: C32.1 15.6,7.93 U11.6
N$60
  Top 0.381: R32.1 C32.2 18.29,7.02 R33.2
N$61
  Top 0.381: R34.2 10.79,5.71 10.55,5.47 U12.1
N$62
  Top 0.381: R34.1 14.6,5.71 14.85,5.47 U12.8
N$63
  Top 0.381: C35.1 15.6,2.85 U12.6
N$64
  Top 0.381: R35.1 C35.2 18.29,1.94 R36.2
N$65
  Top 0.254: U17.60 61.23,51.28 R45.2
N$66
  Top 0.254: U17.7 53.45,57.45 R46.2
N$67
  Top 0.254: R44.2 C53.2 | C53.2 R43.1 | C53.2 4.34,58.74 U16.3
N$68
  Top 0.381: LED1.A R47.1
N$69
  Top 0.381: LED2.A 41.66,7.79 R48.1
N$70
  Top 0.381: LED3.A 42.54,20.16 43.34,20.96 R49.1
N$71
  Top 0.381: R50.1 LED4.A
N$72
  Top 0.381: R51.1 LED5.A
N$73
  Top 0.381: R52.1 45.02,41.5 LED6.A
N$74
  Top 0.254: R54.2 58.23,27.32 J1.A5
N$75
  Top 0.254: R53.1 58.15,30.32 J1.B5
N$76
  Top 0.254: IC1.2 43.44,13.33 42.8,13.97 JP5.2
N$78
  Top 0.254: JP6.2 52.7,22.86 54.53,21.03 IC2.4 IC2.2
SWCLK
  Top 0.254: U17.49 58.42,45.77 59.01,45.77 63.5,41.27 63.5,39.69 JP4.2
SWDIO
  Top 0.254: JP4.3 56.2,40.32 55.45,41.07 U17.46
UART_RX
  Top 0.254: JP3.3 62.8,48.89 61.19,47.28 U17.52
UART_TX
  Top 0.254: JP3.2 61.59,46.36 61.17,46.78 U17.51
USB+
  Top 0.254: U17.45 54.95,30.77 56.4,29.32 J1.B6 60.21,29.32 60.32,29.21 60.32,28.57 60.07,28.32 J1.A6
USB-
  Top 0.254: U17.44 54.45,29.36 55.99,27.82 58.42,27.82 | 58.42,27.82 J1.B7 | J1.A7 58.67,28.82 58.42,28.57 58.42,27.82
VBUS
  Top 0.254: J1.A4_B9 60.16,26.18 60.96,26.97 60.96,30.1 60.08,30.97 J1.B4_A9

### Text on the board
tPlace: 2V5 | Twin Io V00-00-00 | By Pascal Bilger 03.03.2024 | ADC0 | ADC1 | ADC2 | RX | REF(RL) | TX | LD0(LL) | ADC3 | GND | LD1(RA) | LD2(LA) | SWDIO | ADC4 | LD3(V1) | SWCLK | LD4(V2) | GND | ADC5 | LD5(V3) | LD6(V4) | ADC6 | LD7(V5) | LD8(V6) | 3V3 | ADC7 | LD9 | LD10 | ADC8 | 3V3 | LD11 | SPARE | GND | ADC9 | 5V | 9V_IN | ADC10 | ADC11 | 9V | 5V